# EasyEDA Pro project ProProject_fpga_cpu_2024-09-28.epro, board PCB3
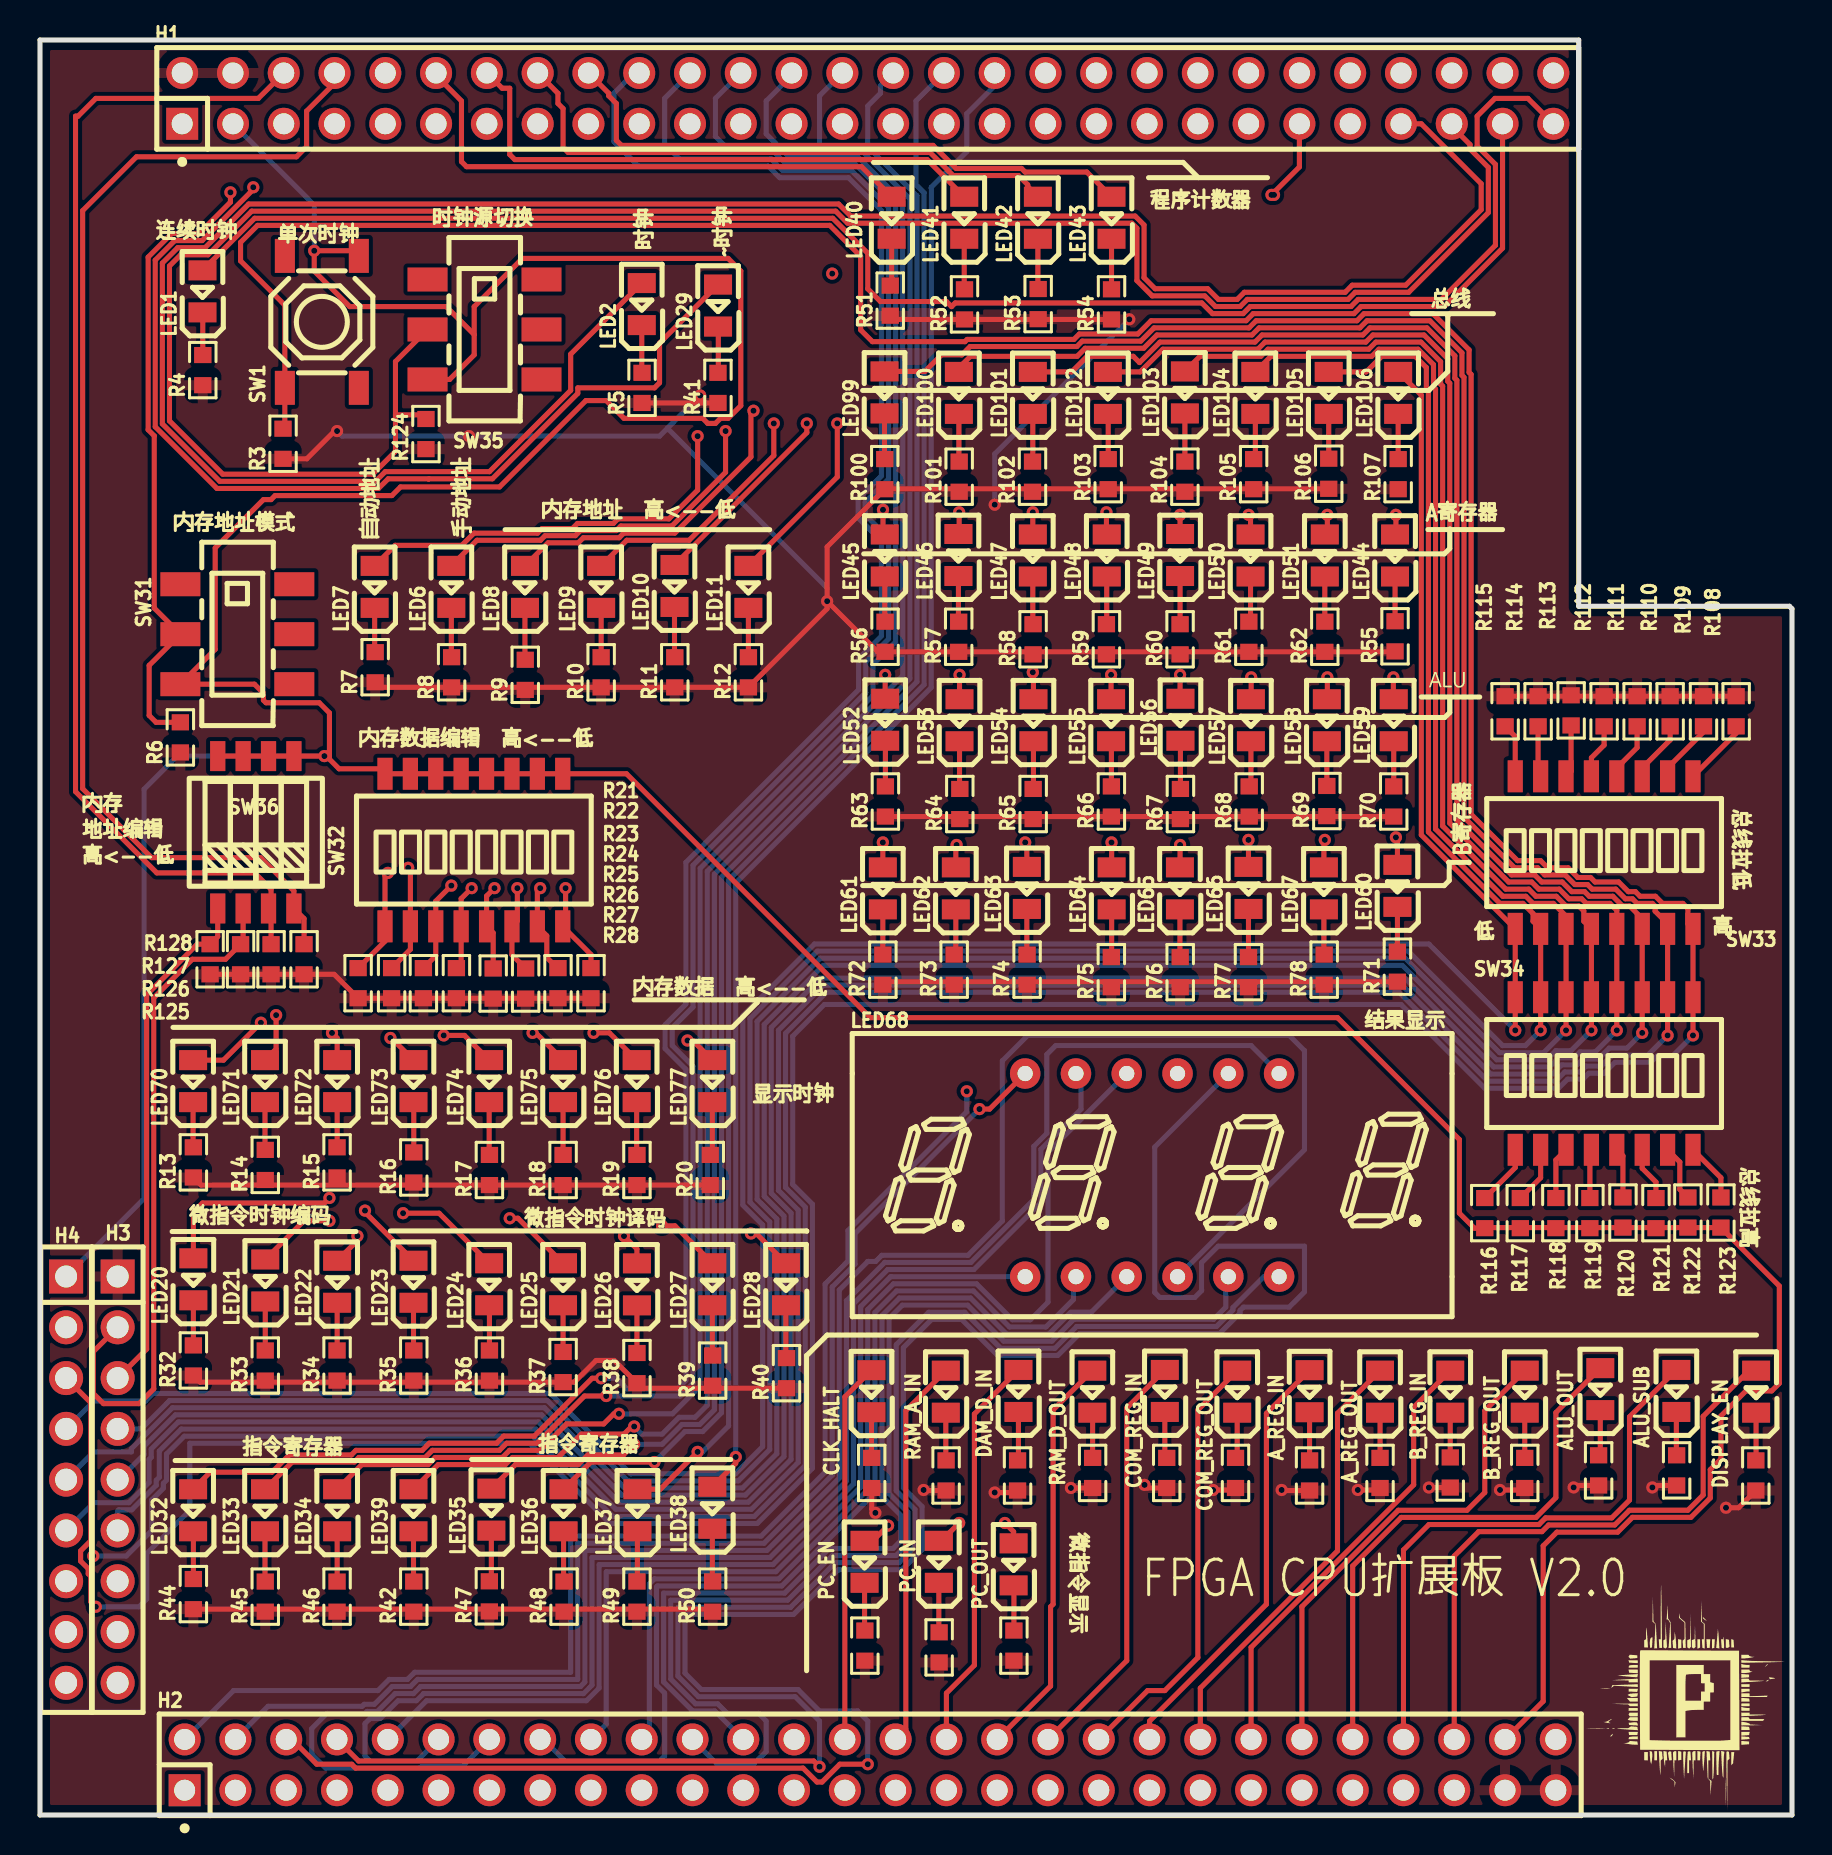
[diagram p3: board, top side]
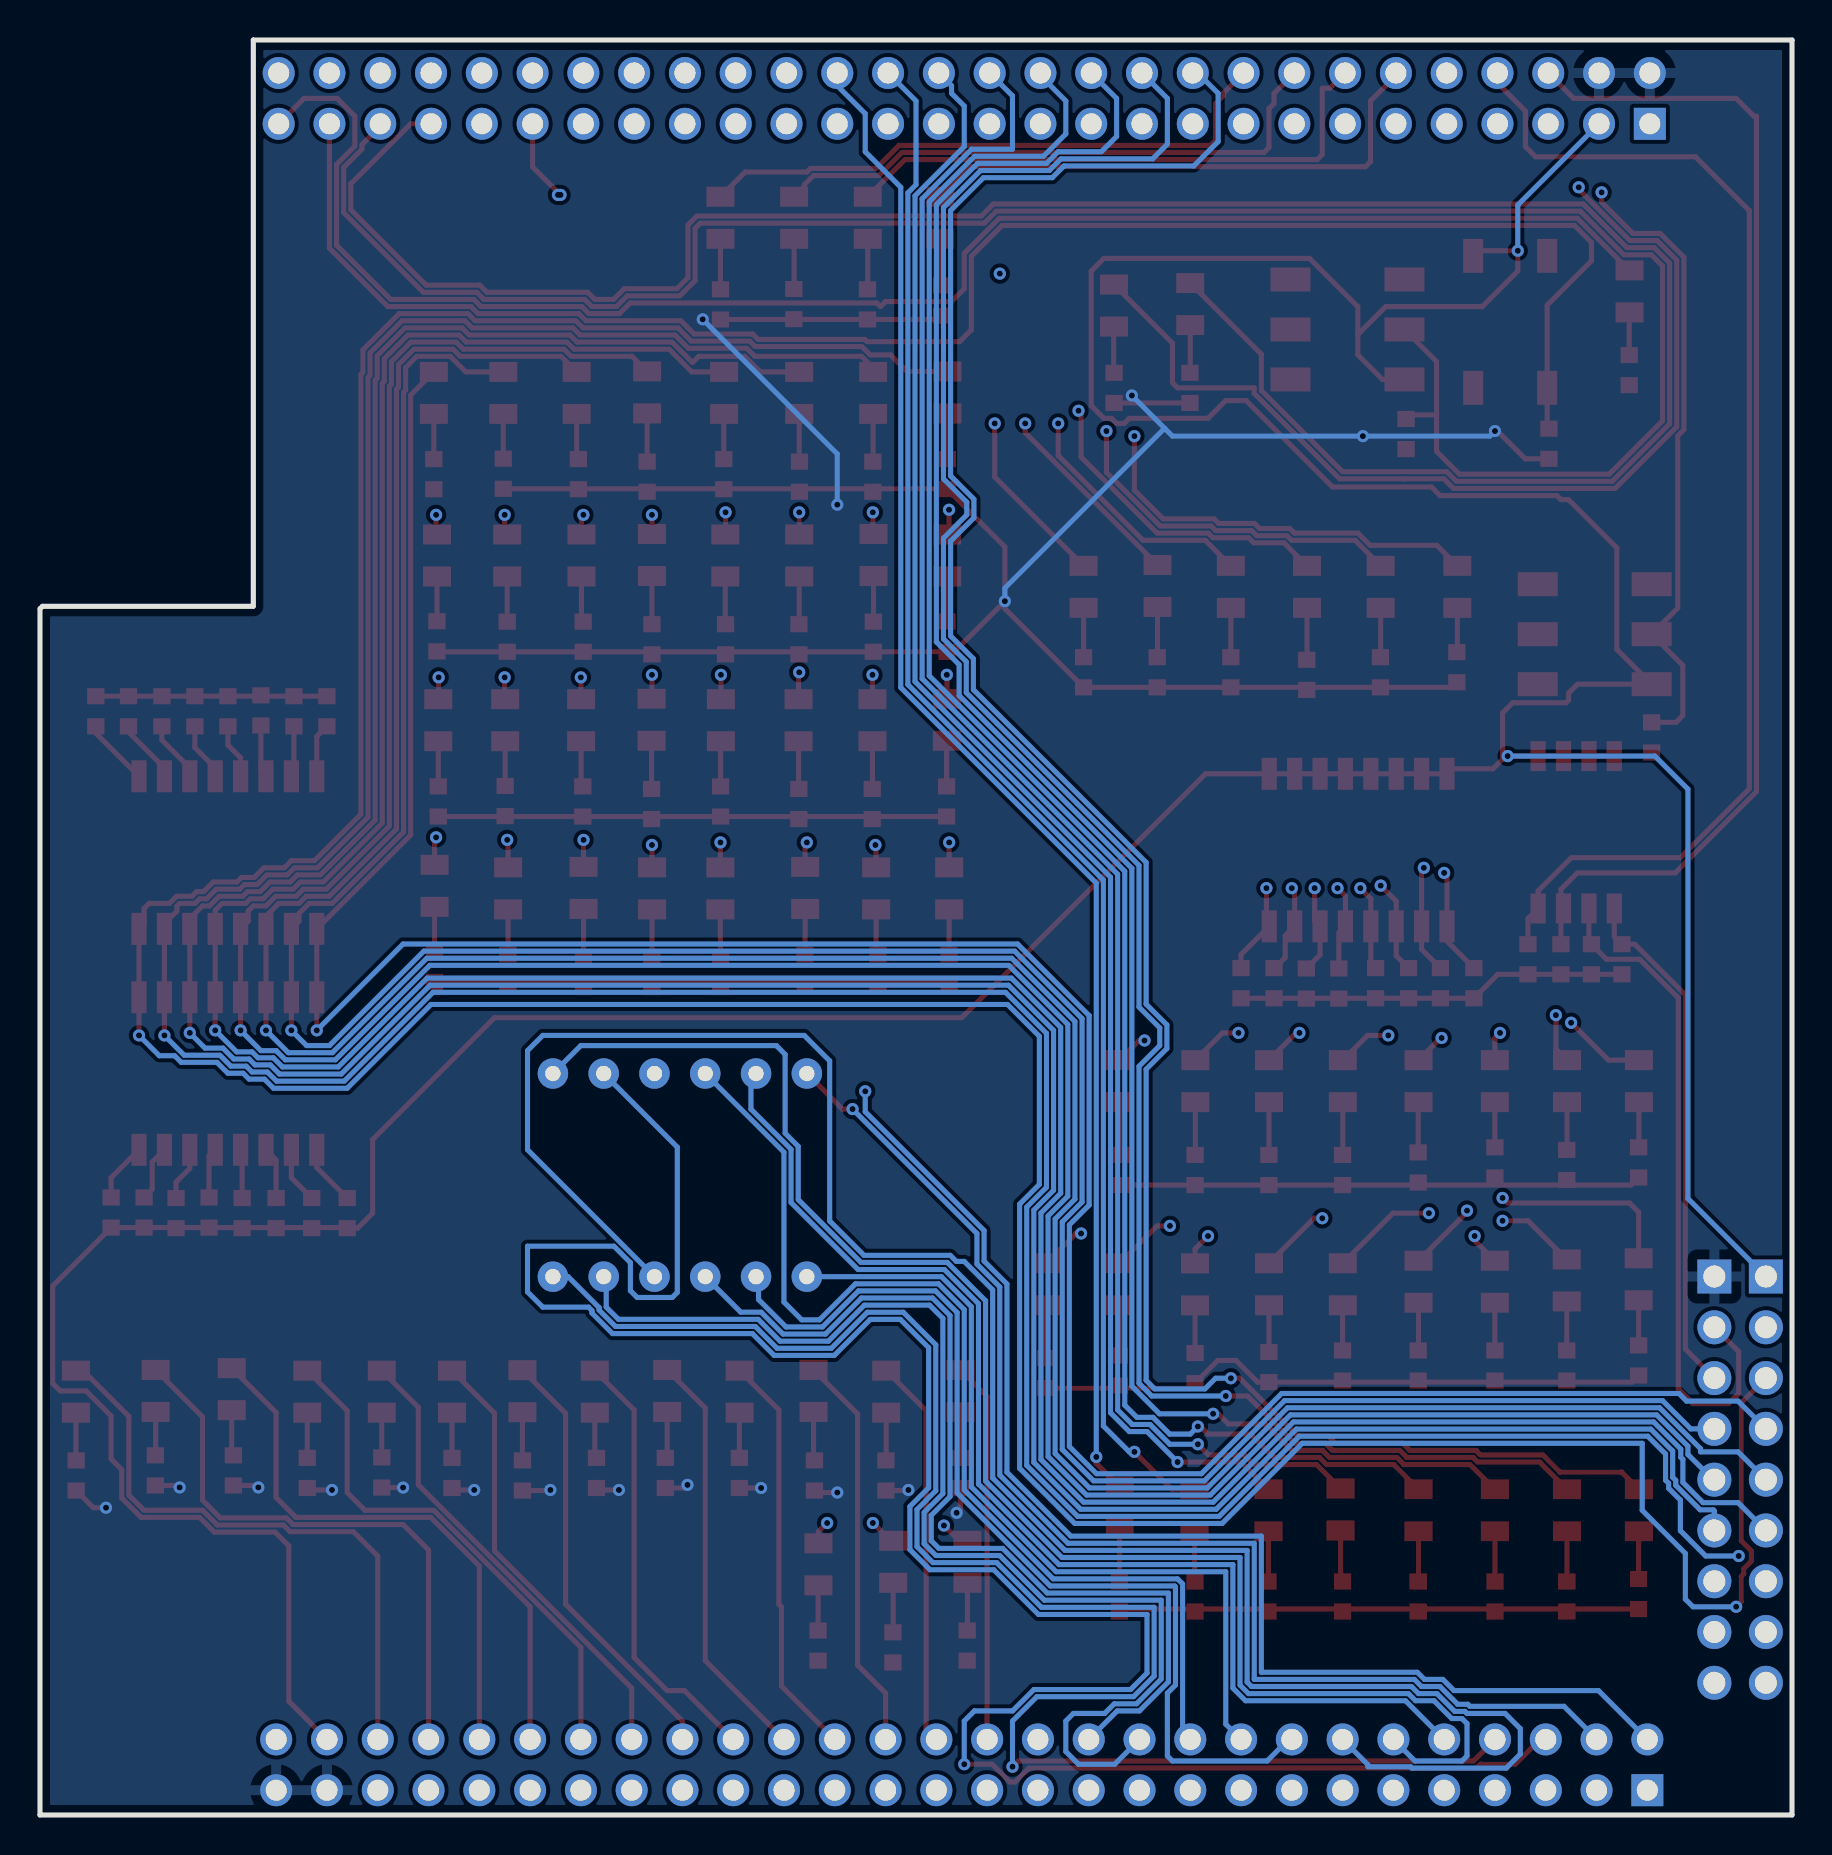
[diagram p4: board, bottom side, seen from below]

Outline 87.63 x 88.77 mm; copper layers: Top Layer, Inner1, Inner2, Bottom Layer. Coordinates in mm from the lower left corner of the outline.
Outline path: 0,88.77 76.96,88.77 76.96,60.45 87.5,60.45 87.63,60.33 87.63,0 0,0 0,88.77
Stack: Top Layer 0.035mm 外层铜厚1oz / Dielectric1 0.2104mm 7628 RC49% 8.6mil / Inner1 0.0152mm 内层铜厚 / Dielectric2 1.065mm 1.1mm H/HOZ 含铜 / Inner2 0.0152mm 内层铜厚 / Dielectric3 0.2104mm 7628 RC49% 8.6mil / Bottom Layer 0.035mm 外层铜厚1oz

## Design rules (mm)
template: JLCPCB Capability(Two Layers Board)
spacing copperThickness1oz (default): track to track 0.102, other pairs 0.152 to 0.3
spacing copperThickness2oz: track to track 0.203, other pairs 0.152 to 0.3
track width copperThickness1oz (default): min 0.127, default 0.254, max 2.54
track width copperThickness2oz: min 0.203, default 0.254, max 2.54
differential pair differentialPair (default): width min 0.127, default 0.254, max 2.54; gap min 0.152, default 0.152
via viaSize (default): diameter min 0.5, default 0.61, max 10; hole min 0.3, default 0.305, max 6.3

## Placement (name value [footprint] x y rotation side)
A_REG_IN  KT-0805G  [LED0805-R-RD]  63.5 21.2 90 top
A_REG_OUT  KT-0805G  [LED0805-R-RD]  67.02 21.17 90 top
ALU_OUT  KT-0805G  [LED0805-R-RD]  78.04 21.3 90 top
ALU_SUB  KT-0805G  [LED0805-R-RD]  81.84 21.21 90 top
B_REG_IN  KT-0805G  [LED0805-R-RD]  70.54 21.17 90 top
B_REG_OUT  KT-0805G  [LED0805-R-RD]  74.26 21.17 90 top
CLK_HALT  KT-0805G  [LED0805-R-RD]  41.59 21.2 90 top
COM_REG_IN  KT-0805G  [LED0805-R-RD]  56.26 21.21 90 top
COM_REG_OUT  KT-0805G  [LED0805-R-RD]  59.88 21.17 90 top
DAM_D_IN  KT-0805G  [LED0805-R-RD]  48.94 21.21 90 top
DISPLAY_EN  KT-0805G  [LED0805-R-RD]  85.83 21.17 90 top
H1  X6521WV-2x28H-C60D30  [HDR-TH_56P-2.54-V-M-R2-C28-S2.54]  41.4 85.85 0 top
H2  X6521WV-2x28H-C60D30  [HDR-TH_56P-2.54-V-M-R2-C28-S2.54]  41.53 2.51 0 top
H3  -  [HDR-TH_9P-P2.54-V-M]  3.88 16.77 270 top
H4  -  [HDR-TH_9P-P2.54-V-M]  1.31 16.77 270 top
LED1  KT-0805Y  [LED0805-R-RD]  8.13 76.2 90 top
LED2  KT-0805Y  [LED0805-R-RD]  30.1 75.57 90 top
LED6  KT-0805Y  [LED0805-R-RD]  20.57 61.42 90 top
LED7  KT-0805G  [LED0805-R-RD]  16.74 61.42 90 top
LED8  KT-0805Y  [LED0805-R-RD]  24.26 61.42 90 top
LED9  KT-0805Y  [LED0805-R-RD]  28.07 61.42 90 top
LED10  KT-0805Y  [LED0805-R-RD]  31.74 61.47 90 top
LED11  KT-0805Y  [LED0805-R-RD]  35.43 61.42 90 top
LED20  KT-0805Y  [LED0805-R-RD]  7.67 26.79 90 top
LED21  KT-0805Y  [LED0805-R-RD]  11.27 26.73 90 top
LED22  KT-0805Y  [LED0805-R-RD]  14.86 26.67 90 top
LED23  KT-0805G  [LED0805-R-RD]  18.68 26.67 90 top
LED24  KT-0805G  [LED0805-R-RD]  22.47 26.54 90 top
LED25  KT-0805G  [LED0805-R-RD]  26.16 26.54 90 top
LED26  KT-0805G  [LED0805-R-RD]  29.86 26.54 90 top
LED27  KT-0805G  [LED0805-R-RD]  33.63 26.54 90 top
LED28  KT-0805G  [LED0805-R-RD]  37.31 26.54 90 top
LED29  KT-0805Y  [LED0805-R-RD]  33.91 75.49 90 top
LED32  KT-0805G  [LED0805-R-RD]  7.66 15.24 90 top
LED33  KT-0805G  [LED0805-R-RD]  11.25 15.24 90 top
LED34  KT-0805G  [LED0805-R-RD]  14.86 15.24 90 top
LED35  KT-0805Y  [LED0805-R-RD]  22.58 15.27 90 top
LED36  KT-0805Y  [LED0805-R-RD]  26.19 15.24 90 top
LED37  KT-0805Y  [LED0805-R-RD]  29.88 15.24 90 top
LED38  KT-0805Y  [LED0805-R-RD]  33.63 15.37 90 top
LED39  KT-0805G  [LED0805-R-RD]  18.68 15.24 90 top
LED40  KT-0805G  [LED0805-R-RD]  42.6 79.88 90 top
LED41  KT-0805G  [LED0805-R-RD]  46.23 79.88 90 top
LED42  KT-0805G  [LED0805-R-RD]  49.91 79.88 90 top
LED43  KT-0805G  [LED0805-R-RD]  53.59 79.88 90 top
LED44  KT-0805W  [LED0805-R-RD]  67.77 62.99 90 top
LED45  KT-0805W  [LED0805-R-RD]  42.25 62.99 90 top
LED46  KT-0805W  [LED0805-R-RD]  45.94 63.02 90 top
LED47  KT-0805W  [LED0805-R-RD]  49.66 62.99 90 top
LED48  KT-0805W  [LED0805-R-RD]  53.35 62.99 90 top
LED49  KT-0805W  [LED0805-R-RD]  57.02 63.02 90 top
LED50  KT-0805W  [LED0805-R-RD]  60.55 62.99 90 top
LED51  KT-0805W  [LED0805-R-RD]  64.26 62.99 90 top
LED52  KT-0805G  [LED0805-R-RD]  42.27 54.78 90 top
LED53  KT-0805G  [LED0805-R-RD]  45.99 54.75 90 top
LED54  KT-0805G  [LED0805-R-RD]  49.69 54.75 90 top
LED55  KT-0805G  [LED0805-R-RD]  53.57 54.75 90 top
LED56  KT-0805G  [LED0805-R-RD]  57.04 54.78 90 top
LED57  KT-0805G  [LED0805-R-RD]  60.57 54.75 90 top
LED58  KT-0805G  [LED0805-R-RD]  64.36 54.75 90 top
LED59  KT-0805G  [LED0805-R-RD]  67.71 54.75 90 top
LED60  KT-0805W  [LED0805-R-RD]  67.89 46.47 90 top
LED61  KT-0805W  [LED0805-R-RD]  42.16 46.34 90 top
LED62  KT-0805W  [LED0805-R-RD]  45.81 46.34 90 top
LED63  KT-0805W  [LED0805-R-RD]  49.36 46.37 90 top
LED64  KT-0805W  [LED0805-R-RD]  53.6 46.34 90 top
LED65  KT-0805W  [LED0805-R-RD]  57.02 46.34 90 top
LED66  KT-0805W  [LED0805-R-RD]  60.44 46.37 90 top
LED67  KT-0805W  [LED0805-R-RD]  64.22 46.34 90 top
LED68  FJ3461AH  [LED-SEG-TH_12P-L30.0-W14.0-P2.54-S10.16-BL]  55.63 32 0 top
LED70  NCD0805R1  [LED0805-R-RD]  7.66 36.7 90 top
LED71  NCD0805R1  [LED0805-R-RD]  11.25 36.7 90 top
LED72  NCD0805R1  [LED0805-R-RD]  14.86 36.7 90 top
LED73  NCD0805R1  [LED0805-R-RD]  18.68 36.7 90 top
LED74  NCD0805R1  [LED0805-R-RD]  22.47 36.7 90 top
LED75  NCD0805R1  [LED0805-R-RD]  26.16 36.7 90 top
LED76  NCD0805R1  [LED0805-R-RD]  29.84 36.7 90 top
LED77  NCD0805R1  [LED0805-R-RD]  33.63 36.7 90 top
LED99  KT-0805Y  [LED0805-R-RD]  42.24 71.15 90 top
LED100  KT-0805Y  [LED0805-R-RD]  45.96 71.12 90 top
LED101  KT-0805Y  [LED0805-R-RD]  49.66 71.12 90 top
LED102  KT-0805Y  [LED0805-R-RD]  53.41 71.12 90 top
LED103  KT-0805Y  [LED0805-R-RD]  57.26 71.15 90 top
LED104  KT-0805Y  [LED0805-R-RD]  60.79 71.12 90 top
LED105  KT-0805Y  [LED0805-R-RD]  64.46 71.12 90 top
LED106  KT-0805Y  [LED0805-R-RD]  67.93 71.12 90 top
PC_EN  KT-0805G  [LED0805-R-RD]  41.24 12.66 90 top
PC_IN  KT-0805G  [LED0805-R-RD]  44.96 12.66 90 top
PC_OUT  KT-0805G  [LED0805-R-RD]  48.7 12.54 90 top
R3  1kΩ  [R0603]  12.16 68.58 90 top
R4  330Ω  [R0603]  8.14 72.26 90 top
R5  330Ω  [R0603]  30.11 71.37 90 top
R6  1kΩ  [R0603]  7.02 53.89 90 top
R7  330Ω  [R0603]  16.76 57.4 90 top
R8  330Ω  [R0603]  20.59 57.15 90 top
R9  330Ω  [R0603]  24.27 57.02 90 top
R10  330Ω  [R0603]  28.07 57.15 90 top
R11  330Ω  [R0603]  31.75 57.15 90 top
R12  330Ω  [R0603]  35.43 57.15 90 top
R13  330Ω  [R0603]  7.67 32.64 90 top
R14  330Ω  [R0603]  11.27 32.51 90 top
R15  330Ω  [R0603]  14.86 32.64 90 top
R16  330Ω  [R0603]  18.7 32.39 90 top
R17  330Ω  [R0603]  22.48 32.26 90 top
R18  330Ω  [R0603]  26.16 32.26 90 top
R19  330Ω  [R0603]  29.86 32.26 90 top
R20  330Ω  [R0603]  33.52 32.26 90 top
R21  1kΩ  [R0603]  15.91 41.6 90 top
R22  1kΩ  [R0603]  17.59 41.6 90 top
R23  1kΩ  [R0603]  19.18 41.6 90 top
R24  1kΩ  [R0603]  20.83 41.6 90 top
R25  1kΩ  [R0603]  22.67 41.58 90 top
R26  1kΩ  [R0603]  24.29 41.58 90 top
R27  1kΩ  [R0603]  25.91 41.6 90 top
R28  1kΩ  [R0603]  27.56 41.6 90 top
R32  330Ω  [R0603]  7.67 22.73 90 top
R33  330Ω  [R0603]  11.27 22.48 90 top
R34  330Ω  [R0603]  14.86 22.48 90 top
R35  330Ω  [R0603]  18.7 22.48 90 top
R36  330Ω  [R0603]  22.48 22.48 90 top
R37  330Ω  [R0603]  26.16 22.4 90 top
R38  330Ω  [R0603]  29.86 22.35 90 top
R39  330Ω  [R0603]  33.64 22.23 90 top
R40  330Ω  [R0603]  37.34 22.1 90 top
R41  330Ω  [R0603]  33.91 71.37 90 top
R42  330Ω  [R0603]  18.7 10.92 90 top
R44  330Ω  [R0603]  7.67 11.05 90 top
R45  330Ω  [R0603]  11.27 10.92 90 top
R46  330Ω  [R0603]  14.86 10.92 90 top
R47  330Ω  [R0603]  22.48 10.94 90 top
R48  330Ω  [R0603]  26.21 10.92 90 top
R49  330Ω  [R0603]  29.86 10.92 90 top
R50  330Ω  [R0603]  33.64 10.92 90 top
R51  330Ω  [R0603]  42.53 75.74 90 top
R52  330Ω  [R0603]  46.24 75.55 90 top
R53  330Ω  [R0603]  49.92 75.57 90 top
R54  330Ω  [R0603]  53.59 75.55 90 top
R55  330Ω  [R0603]  67.77 58.95 90 top
R56  330Ω  [R0603]  42.27 58.93 90 top
R57  330Ω  [R0603]  45.95 58.93 90 top
R58  330Ω  [R0603]  49.67 58.8 90 top
R59  330Ω  [R0603]  53.34 58.8 90 top
R60  330Ω  [R0603]  57.02 58.8 90 top
R61  330Ω  [R0603]  60.46 58.93 90 top
R62  330Ω  [R0603]  64.26 58.93 90 top
R63  330Ω  [R0603]  42.28 50.69 90 top
R64  330Ω  [R0603]  46.01 50.56 90 top
R65  330Ω  [R0603]  49.67 50.56 90 top
R66  330Ω  [R0603]  53.59 50.69 90 top
R67  330Ω  [R0603]  57.04 50.56 90 top
R68  330Ω  [R0603]  60.48 50.69 90 top
R69  330Ω  [R0603]  64.36 50.71 90 top
R70  330Ω  [R0603]  67.71 50.69 90 top
R71  330Ω  [R0603]  67.89 42.43 90 top
R72  330Ω  [R0603]  42.16 42.28 90 top
R73  330Ω  [R0603]  45.72 42.28 90 top
R74  330Ω  [R0603]  49.37 42.28 90 top
R75  330Ω  [R0603]  53.59 42.15 90 top
R76  330Ω  [R0603]  57.03 42.15 90 top
R77  330Ω  [R0603]  60.44 42.15 90 top
R78  330Ω  [R0603]  64.23 42.28 90 top
R80  330Ω  [R0603]  41.6 17.11 90 top
R81  330Ω  [R0603]  45.32 16.98 90 top
R82  330Ω  [R0603]  48.89 16.98 90 top
R83  330Ω  [R0603]  52.65 17.11 90 top
R84  330Ω  [R0603]  56.36 17.11 90 top
R85  330Ω  [R0603]  59.8 17.11 90 top
R86  330Ω  [R0603]  63.5 16.98 90 top
R87  330Ω  [R0603]  67.02 17.11 90 top
R88  330Ω  [R0603]  70.54 17.13 90 top
R89  330Ω  [R0603]  74.26 17.11 90 top
R90  330Ω  [R0603]  77.96 17.24 90 top
R91  330Ω  [R0603]  81.86 17.24 90 top
R92  330Ω  [R0603]  85.82 16.98 90 top
R93  330Ω  [R0603]  41.26 8.47 90 top
R94  330Ω  [R0603]  44.97 8.38 90 top
R95  330Ω  [R0603]  48.71 8.47 90 top
R100  330Ω  [R0603]  42.25 67.06 90 top
R101  330Ω  [R0603]  45.97 66.93 90 top
R102  330Ω  [R0603]  49.64 66.93 90 top
R103  330Ω  [R0603]  53.43 67.06 90 top
R104  330Ω  [R0603]  57.26 66.93 90 top
R105  330Ω  [R0603]  60.7 67.06 90 top
R106  330Ω  [R0603]  64.46 67.08 90 top
R107  330Ω  [R0603]  67.93 67.06 90 top
R108  1kΩ  [R0603]  84.84 55.2 270 top
R109  1kΩ  [R0603]  83.2 55.2 270 top
R110  1kΩ  [R0603]  81.53 55.2 270 top
R111  1kΩ  [R0603]  79.88 55.2 270 top
R112  1kΩ  [R0603]  78.23 55.2 270 top
R113  1kΩ  [R0603]  76.58 55.25 270 top
R114  1kΩ  [R0603]  74.93 55.2 270 top
R115  1kΩ  [R0603]  73.28 55.2 270 top
R116  1kΩ  [R0603]  72.26 30.1 90 top
R117  1kΩ  [R0603]  74.04 30.1 90 top
R118  1kΩ  [R0603]  75.82 30.1 90 top
R119  1kΩ  [R0603]  77.52 30.1 90 top
R120  1kΩ  [R0603]  79.17 30.13 90 top
R121  1kΩ  [R0603]  80.83 30.1 90 top
R122  1kΩ  [R0603]  82.42 30.13 90 top
R123  1kΩ  [R0603]  84.07 30.13 90 top
R124  1kΩ  [R0603]  19.3 69.06 90 top
R125  1kΩ  [R0603]  8.51 42.8 90 top
R126  1kΩ  [R0603]  10.03 42.8 90 top
R127  1kΩ  [R0603]  11.56 42.8 90 top
R128  1kΩ  [R0603]  13.21 42.8 90 top
RAM_A_IN  KT-0805G  [LED0805-R-RD]  45.31 21.17 90 top
RAM_D_OUT  KT-0805G  [LED0805-R-RD]  52.63 21.17 90 top
SW1  TS-1187A-B-A-B  [SW-SMD_4P-L5.1-W5.1-P3.70-LS6.5-TL-2]  14.1 74.68 90 top
SW31  MST22D18G2  [SW-SMD_MST22D18G2]  9.87 59.06 270 top
SW32  DSHP08TSGER  [SW-SMD_16P-L11.7-W5.4-P1.27-LS8.5]  21.7 48.26 0 top
SW33  DSHP08TSGER  [SW-SMD_16P-L11.7-W5.4-P1.27-LS8.5]  78.23 48.13 180 top
SW34  DSHP08TSGER  [SW-SMD_16P-L11.7-W5.4-P1.27-LS8.5]  78.23 37.08 0 top
SW35  MST22D18G2  [SW-SMD_MST22D18G2]  22.23 74.3 270 top
SW36  DSHP04TS-S  [SW-SMD_8P-L6.7-W5.4-P1.27-LS8.5]  10.8 49.15 0 top

## Footprints (pads in the part's own frame, mm; a bottom-side part is the same pattern mirrored in y, then rotated)
HDR-TH_9P-P2.54-V-M
  rect 1.7x1.7 hole 1.1: 1(-10.16,0)
  round 1.7 hole 1.1: 2(-7.62,0) 3(-5.08,0) 4(-2.54,0) 5(0,0) 6(2.54,0) 7(5.08,0) 8(7.62,0) 9(10.16,0)
HDR-TH_56P-2.54-V-M-R2-C28-S2.54
  rect 1.6x1.6 hole 1.05: 1(-34.29,-1.27)
  round 1.6 hole 1.05: 2(-34.29,1.27) 3(-31.75,-1.27) 4(-31.75,1.27) 5(-29.21,-1.27) 6(-29.21,1.27) 7(-26.67,-1.27) 8(-26.67,1.27) 9(-24.13,-1.27) 10(-24.13,1.27) 11(-21.59,-1.27) 12(-21.59,1.27) 13(-19.05,-1.27) 14(-19.05,1.27) 15(-16.51,-1.27) 16(-16.51,1.27) 17(-13.97,-1.27) 18(-13.97,1.27) 19(-11.43,-1.27) 20(-11.43,1.27) 21(-8.89,-1.27) 22(-8.89,1.27) 23(-6.35,-1.27) 24(-6.35,1.27) 25(-3.81,-1.27) 26(-3.81,1.27) 27(-1.27,-1.27) 28(-1.27,1.27) 29(1.27,-1.27) 30(1.27,1.27) 31(3.81,-1.27) 32(3.81,1.27) 33(6.35,-1.27) 34(6.35,1.27) 35(8.89,-1.27) 36(8.89,1.27) 37(11.43,-1.27) 38(11.43,1.27) 39(13.97,-1.27) 40(13.97,1.27) 41(16.51,-1.27) 42(16.51,1.27) 43(19.05,-1.27) 44(19.05,1.27) 45(21.59,-1.27) 46(21.59,1.27) 47(24.13,-1.27) 48(24.13,1.27) 49(26.67,-1.27) 50(26.67,1.27) 51(29.21,-1.27) 52(29.21,1.27) 53(31.75,-1.27) 54(31.75,1.27) 55(34.29,-1.27) 56(34.29,1.27)
LED0805-R-RD
  rect 1x1.399 smd: 1(1.05,0) 2(-1.05,0)
LED-SEG-TH_12P-L30.0-W14.0-P2.54-S10.16-BL
  round 1.524 hole 0.762: 1(-6.35,-5.08) 2(-3.81,-5.08) 3(-1.27,-5.08) 4(1.27,-5.08) 5(3.81,-5.08) 6(6.35,-5.08) 7(6.35,5.08) 8(3.81,5.08) 9(1.27,5.08) 10(-1.27,5.08) 11(-3.81,5.08) 12(-6.35,5.08)
R0603
  rect 0.806x0.864 smd: 1(-0.753,0) 2(0.753,0)
SW-SMD_4P-L5.1-W5.1-P3.70-LS6.5-TL-2
  rect 1.7x1 smd: 1(-3.3,1.85) 2(3.3,1.85) 3(-3.3,-1.85) 4(3.3,-1.85)
SW-SMD_8P-L6.7-W5.4-P1.27-LS8.5
  rect 0.762x1.5 smd: 1(-1.905,-3.81) 2(-0.635,-3.81) 3(0.635,-3.81) 4(1.905,-3.81) 5(1.905,3.81) 6(0.635,3.81) 7(-0.635,3.81) 8(-1.905,3.81)
SW-SMD_16P-L11.7-W5.4-P1.27-LS8.5
  rect 0.76x1.6 smd: 1(-4.445,-3.815) 2(-3.175,-3.815) 3(-1.905,-3.815) 4(-0.635,-3.815) 5(0.635,-3.815) 6(1.905,-3.815) 7(3.175,-3.815) 8(4.445,-3.815) 9(-4.445,3.815) 10(-3.175,3.815) 11(-1.905,3.815) 12(-0.635,3.815) 13(0.635,3.815) 14(1.905,3.815) 15(3.175,3.815) 16(4.445,3.815)
SW-SMD_MST22D18G2
  rect 1.2x2 smd: 1(-2.5,2.85) 2(0,2.85) 3(2.5,2.85) 4(-2.5,-2.85) 5(0,-2.85) 6(2.5,-2.85)

## Nets
As in the schematic, except:
AA8: ALU_SUB.1 H2.50
AB6: ALU_OUT.1 H2.48
AB7: B_REG_OUT.1 H2.46
COMMAND_R1: CLK_HALT.1 H2.28
COMMAND_R2: H2.30 RAM_A_IN.1
COMMAND_R3: DAM_D_IN.1 H2.32
COMMAND_R4: H2.34 RAM_D_OUT.1
COMMAND_R5: COM_REG_IN.1 H2.36
COMMAND_R6: COM_REG_OUT.1 H2.38
COMMAND_R7: A_REG_IN.1 H2.40
COMMAND_R8: A_REG_OUT.1 H2.42
COMMAND_R9: B_REG_IN.1 H2.44
COMMAND_R13: DISPLAY_EN.1 H2.52
COMMAND_R14: H2.3 PC_EN.1
COMMAND_R15: H2.1 PC_IN.1
COMMAND_R16: H1.10 PC_OUT.1
$1N12783: CLK_HALT.2 R80.2
$1N12882: R81.2 RAM_A_IN.2
$1N13075: DAM_D_IN.2 R82.2
$1N13079: R83.2 RAM_D_OUT.2
$1N13657: COM_REG_IN.2 R84.2
$1N13661: COM_REG_OUT.2 R85.2
$1N13665: A_REG_IN.2 R86.2
$1N13669: A_REG_OUT.2 R87.2
$1N14429: B_REG_IN.2 R88.2
$1N14433: B_REG_OUT.2 R89.2
$1N14437: ALU_OUT.2 R90.2
$1N14441: ALU_SUB.2 R91.2
$1N14445: DISPLAY_EN.2 R92.2
$1N14449: PC_EN.2 R93.2
$1N14453: PC_IN.2 R94.2
$1N14457: PC_OUT.2 R95.2

Pads without a net: H3 7 8 9; H4 7 8 9; SW1 2 3; SW31 1 2 3 4; SW35 1 2 3 4

## Via types
v1: diameter 0.61, hole 0.305, Top Layer to Bottom Layer, 106 vias

## Routing (per net, layer and track width the routed paths; a pad name or vN(x,y) marks a point on that pad's centre or on a via; arc(x,y) is an arc through that point)
+3.3V: length 255.2
  Top Layer w0.254: SW1.4 15.69,78.23 v1(13.72,78.23) 13.72,77.22 15.49,75.44 20.32,75.44 21.72,74.04 ; 21.72,74.04 21.72,73.03 20.49,71.8 SW35.6 ; 21.72,74.04 21.72,75.44 24.13,77.85 34.42,77.85 35.05,77.22 35.05,70.49 34.42,69.85 34.04,69.85 33.78,69.6 33.4,69.6 33.15,69.85 29.21,69.85 28.32,70.74 27.31,70.74 22.99,66.42 18.03,66.42 17.6,65.99 11.76,65.99 11.56,65.79 11.18,65.79 8.76,63.37 8.76,58.3 SW31.6 10.73,56.56 11.18,56.1 11.18,55.75 11.3,55.63 13.97,55.63 14.48,55.12 14.48,53.21 ; H2.54 75.18,5.69 75.18,13.46 75.87,14.15 78.91,14.15 79.65,14.89 82.57,14.89 83.54,15.85 83.54,17.27 84.07,17.81 84.07,19.96 85.32,21.21 86.61,21.21 87,21.59 87,26.46 R123.1 R122.1 R120.1 72.29,29.38 R116.1 71.74,29.35 70.99,30.1 70.99,33.78 64.9,39.88 41.53,39.88 29.33,52.08 SW32.16 SW32.15 SW32.14 SW32.13 SW32.12 SW32.11 SW32.10 SW32.9 17.01,52.32 14.96,52.32 14.48,52.8 14.48,53.21 ; SW36.8 SW36.7 SW36.6 SW36.5 14.22,52.96 14.48,53.21
  Bottom Layer w0.254: H4.1 5.21,30.83 5.21,51.31 6.86,52.96 v1(14.22,52.96) ; v1(13.72,78.23) 13.72,80.52 H1.3
GND: length 379.3
  Top Layer w0.254: R88.1 v1(69.47,16.38) ; v1(58.67,16.26) 59.7,16.26 R85.1 ; R84.1 55.4,16.36 v1(55.25,16.51) ; R91.1 80.74,16.48 v1(80.64,16.38) ; v1(14.86,69.22) 14.73,69.22 13.34,67.83 R3.1 ; R90.1 76.81,16.48 v1(76.71,16.38) ; v1(65.91,16.26) 66.92,16.26 R87.1 ; R81.1 44.22,16.23 v1(44.2,16.26) ; R44.1 33.52,10.3 R50.1 ; R32.1 8,21.65 R37.1 26.73,21.65 27.81,22.73 28.72,22.73 R38.1 30.11,21.34 R40.1 ; v1(41.78,15.11) 41.6,15.3 R80.1 ; R86.1 62.13,16.23 v1(62.1,16.26) ; R20.1 R19.1 R18.1 R17.1 8.05,31.5 R13.1 ; 42.16,41.53 42.31,41.67 R71.1 ; R5.1 33.8,70.62 33.93,70.49 ; R51.1 42.71,74.8 53.59,74.8 ; R55.1 67.75,58.17 R62.1 R61.1 R57.1 R56.1 41.9,58.17 v1(39.37,60.71) ; R115.1 R114.1 R112.1 R111.1 R110.1 R109.1 R108.1 ; R70.1 R68.1 R66.1 R63.1 ; v1(47.75,16.13) 48.8,16.13 R82.1 ; v1(39.37,60.71) 39.37,60.33 R12.1 R11.1 R10.1 R8.1 17.02,56.4 R7.1 ; v1(39.37,60.71) 39.37,63.42 R100.1 42.28,66.33 R106.1 ; R83.1 v1(51.56,16.36) ; R125.1 R126.1 R127.1 R128.1 14.71,42.04 R21.1 R22.1 R23.1 R24.1 R27.1 R28.1 ; R89.1 74.16,16.26 v1(73.03,16.26) ; R92.1 84.96,15.37 v1(84.33,15.37)
  Inner1 w0.254: 76.71,15.37 80.55,15.37 ; 76.71,15.37 73.02,15.37 ; 76.71,15.37 v1(76.71,16.38) ; 80.55,15.37 v1(84.33,15.37) ; 80.55,15.37 80.64,15.46 v1(80.64,16.38) ; v1(73.03,16.26) 73.03,15.37 73.02,15.37 ; 65.79,15.37 65.79,16.13 v1(65.91,16.26) ; 65.79,15.37 69.41,15.37 ; 65.79,15.37 62.1,15.37 ; v1(69.47,16.38) 69.47,15.42 69.41,15.37 ; 47.78,15.37 47.75,15.39 v1(47.75,16.13) ; 47.78,15.37 51.56,15.37 ; 47.78,15.37 42.04,15.37 v1(41.78,15.11) ; 69.41,15.37 73.02,15.37 ; v1(62.1,16.26) 62.1,15.37 ; 62.1,15.37 58.66,15.37 ; 55.25,15.37 58.66,15.37 ; 55.25,15.37 51.56,15.37 ; 55.25,15.37 55.25,15.37 v1(55.25,16.51) ; 58.66,15.37 58.67,15.38 v1(58.67,16.26) ; v1(51.56,16.36) 51.56,15.37 ; v1(44.2,16.26) 44.2,15.37
  Bottom Layer w0.254: v1(39.37,60.71) 39.37,61.36 31.38,69.35 ; v1(33.02,70.99) 31.38,69.35 ; 31.38,69.35 30.99,68.96 v1(21.46,68.96) 15.11,68.96 v1(14.86,69.22) ; v1(54.48,74.8) 47.75,68.07 v1(47.75,65.53)
AA8: length 29.3
  Top Layer w0.254: ALU_SUB.1 79.5,19.92 79.5,15.75 78.61,14.86 75.31,14.86 74.98,14.53 69.47,14.53 68.2,13.26 H2.50
AA18: length 53.6
  Bottom Layer w0.254: LED68.10 50.42,33.15 50.42,25.65 49.53,24.77 48.64,24.77 46.84,26.57 42.69,26.57 41.4,25.28 41.4,16.26 36.95,11.81 30.73,11.81 30.48,11.56 30.48,4.16 H2.20
AB6: length 27.7
  Top Layer w0.254: H2.48 65.66,12.46 68.08,14.88 74.83,14.88 75.82,15.88 75.82,20.13 ALU_OUT.1
AB7: length 25.1
  Top Layer w0.254: H2.46 63.12,10.42 67.94,15.24 71.37,15.24 72.26,16.13 72.26,20.22 B_REG_OUT.1
AB8: length 153.8
  Top Layer w0.254: v1(45.85,48.51) 45.81,48.48 LED62.1
  Inner1 w0.254: H2.49 66.8,2.63 66.8,4.32 66.17,4.95 64.39,4.95 63.9,5.43 61.74,5.43 61.38,5.79 59.47,5.79 59.06,6.21 57.02,6.21 56.54,6.69 54.63,6.69 53.91,7.4 49.59,7.4 49.29,7.7 47.64,7.7 47.22,8.12 44.93,8.12 44.45,8.6 42.66,8.6 41.91,9.35 35.67,9.35 35.15,9.87 30.7,9.87 30.09,10.48 28.71,10.48 28.06,11.13 23.46,11.13 23.1,11.49 21.32,11.49 20.52,12.29 18.48,12.29 18.25,12.52 16.35,12.52 15.93,12.93 13.89,12.93 13.39,13.43 13.39,30.96 9.55,34.8 9.55,60.37 34.78,60.37 41.41,53.74 44.17,53.74 45.85,52.07 v1(45.85,48.51)
AB18: length 124.3
  Top Layer w0.254: v1(42.16,65.28) 42.16,64.13 LED45.1
  Inner1 w0.254: v1(42.16,65.28) 42.04,65.28 41.61,65.71 6.24,65.71 3.89,63.36 3.89,31.77 3.95,31.7 5.1,31.7 8.05,28.75 8.05,8.21 11.06,8.21 11.68,7.59 13.71,7.59 14.13,7.18 16.04,7.18 16.27,6.95 18.31,6.95 19.11,6.15 20.89,6.15 21.25,5.79 25.7,5.79 26.35,5.14 27.88,5.14 28.83,4.19 28.83,2.29 29.88,1.24 H2.19
ALU_0: length 156.7
  Top Layer w0.254: v1(67.69,56.9) 67.69,55.82 67.71,55.8
  Inner1 w0.254: v1(67.69,56.9) 67.69,61.34 65.91,63.12 42.16,63.12 40.89,64.39 38.48,64.39 37.52,65.35 6.39,65.35 4.44,63.41 4.44,32.06 5.24,32.06 8.41,28.89 8.41,8.56 11.21,8.56 11.82,7.95 13.86,7.95 14.28,7.53 16.19,7.53 16.42,7.3 18.46,7.3 19.26,6.5 21.04,6.5 21.39,6.15 25.85,6.15 26.5,5.5 28.03,5.5 28.64,4.89 31.05,4.89 31.37,4.57 31.37,2.51 H2.21
ALU_1: length 154.9
  Top Layer w0.254: v1(64.39,56.9) 64.39,55.83 64.36,55.8
  Inner1 w0.254: H2.23 33.78,2.63 33.78,4.7 33.24,5.24 28.78,5.24 28.17,5.85 26.64,5.85 26,6.5 21.54,6.5 21.19,6.86 19.4,6.86 18.6,7.66 16.57,7.66 16.34,7.89 14.43,7.89 14.01,8.31 11.97,8.31 11.36,8.92 8.76,8.92 8.76,29.04 5.39,32.41 4.8,32.41 4.8,63.26 6.53,65 37.37,65 38.33,64.03 40.75,64.03 42.02,62.76 63.73,62.76 64.39,62.1 v1(64.39,56.9)
ALU_2: length 151.7
  Top Layer w0.254: v1(60.58,56.9) 60.58,55.82 60.57,55.8
  Inner1 w0.254: v1(60.58,56.9) 60.58,61.6 59.77,62.41 41.87,62.41 40.6,63.68 38.19,63.68 37.22,64.64 6.68,64.64 5.16,63.11 5.16,32.77 5.54,32.77 9.12,29.19 9.12,9.28 11.51,9.28 12.12,8.66 14.16,8.66 14.58,8.24 16.49,8.24 16.71,8.01 18.75,8.01 19.55,7.21 21.33,7.21 21.69,6.86 26.29,6.86 26.94,6.21 28.32,6.21 28.93,5.6 33.38,5.6 33.9,5.08 35.56,5.08 36.45,4.19 36.45,2.51 H2.25
ALU_3: length 149
  Top Layer w0.254: v1(57.02,57.02) 57.02,55.85 LED56.1
  Inner1 w0.254: v1(57.02,57.02) 57.02,60.71 55.68,62.05 41.72,62.05 40.45,63.32 38.04,63.32 37.08,64.28 6.83,64.28 5.51,62.97 5.51,33.13 5.69,33.13 9.48,29.34 9.48,9.63 11.66,9.63 12.27,9.02 14.3,9.02 14.72,8.6 16.63,8.6 16.86,8.37 18.9,8.37 19.7,7.57 21.48,7.57 21.84,7.21 26.44,7.21 27.09,6.57 28.47,6.57 29.08,5.96 33.53,5.96 34.05,5.44 38.12,5.44 38.86,4.7 38.86,3.65 40.26,2.25 H2.27
ALU_4: length 146.7
  Top Layer w0.254: 53.57,55.8 v1(53.57,57.02)
  Inner1 w0.254: H2.29 42.8,2.25 41.53,3.52 41.53,4.7 40.44,5.79 34.2,5.79 33.68,6.31 29.23,6.31 28.62,6.92 27.23,6.92 26.58,7.57 21.98,7.57 21.63,7.93 19.85,7.93 19.05,8.73 17.01,8.73 16.78,8.96 14.87,8.96 14.45,9.37 12.41,9.37 11.8,9.99 9.83,9.99 9.83,29.48 5.94,33.37 5.94,62.89 6.98,63.93 36.93,63.93 37.89,62.97 40.3,62.97 41.57,61.7 52.6,61.7 53.57,60.73 v1(53.57,57.02)
ALU_5: length 143.7
  Top Layer w0.254: 49.69,55.8 49.69,57.12 v1(49.66,57.15)
  Inner1 w0.254: v1(49.66,57.15) 49.66,60.45 48.77,61.34 41.43,61.34 40.16,62.61 37.74,62.61 36.78,63.57 7.12,63.57 6.3,62.75 6.3,33.52 10.19,29.63 10.19,10.34 11.95,10.34 12.56,9.73 14.6,9.73 15.02,9.31 16.93,9.31 17.16,9.08 19.19,9.08 19.99,8.28 21.78,8.28 22.13,7.93 26.73,7.93 27.38,7.28 28.76,7.28 29.37,6.67 33.83,6.67 34.35,6.15 40.58,6.15 41.34,5.4 43.12,5.4 44.07,4.45 44.07,2.51 H2.31
ALU_6: length 141.3
  Top Layer w0.254: 45.99,55.8 v1(45.99,57.02)
  Inner1 w0.254: v1(45.99,57.02) 45.99,60.18 45.19,60.98 41.28,60.98 40.01,62.25 37.6,62.25 36.63,63.22 7.27,63.22 6.65,62.6 6.65,33.67 10.54,29.78 10.54,10.7 12.1,10.7 12.71,10.09 14.75,10.09 15.17,9.67 17.08,9.67 17.3,9.44 19.34,9.44 20.14,8.64 21.92,8.64 22.28,8.28 26.88,8.28 27.53,7.63 28.91,7.63 29.52,7.02 33.97,7.02 34.49,6.5 40.73,6.5 41.48,5.75 43.27,5.75 43.75,5.27 46.04,5.27 46.61,4.7 46.61,2.51 H2.33
ALU_7: length 138.8
  Top Layer w0.254: LED52.1 v1(42.27,57.02)
  Inner1 w0.254: H2.35 49.15,2.51 49.15,4.32 48.26,5.2 46.61,5.2 46.19,5.62 43.9,5.62 43.41,6.11 41.63,6.11 40.88,6.86 34.64,6.86 34.12,7.38 29.67,7.38 29.06,7.99 27.67,7.99 27.03,8.64 22.43,8.64 22.07,8.99 20.29,8.99 19.49,9.79 17.45,9.79 17.22,10.02 15.31,10.02 14.89,10.44 12.86,10.44 12.24,11.06 10.9,11.06 10.9,29.93 7.01,33.82 7.01,62.45 7.42,62.86 36.49,62.86 37.45,61.9 39.86,61.9 41.13,60.63 42.27,60.63 v1(42.27,57.02)
B13: length 152.7
  Top Layer w0.254: v1(76.33,39.24) SW34.11 76.33,44.96 75.69,45.59 74.67,45.59 74.32,45.95 73.16,45.95 69.8,49.31 69.8,71.31 69.7,71.41 69.7,72.54 68.93,73.31 66.96,73.31 66.61,72.95 61.57,72.95 LED104.1
  Bottom Layer w0.254: H4.5 2.7,18.16 4.57,18.16 4.57,18.32 6.62,20.37 25.23,20.37 29.24,16.36 35.14,16.36 36.86,18.08 36.86,29.81 35.87,30.8 35.87,39.69 39.03,42.85 68.28,42.85 73,38.13 75.21,38.13 v1(76.33,39.24)
B15: length 202
  Top Layer w0.254: v1(2.79,10.41) 2.54,10.67 2.54,11.94 2.41,12.07 2.41,12.32 2.03,12.7 2.03,13.21 2.54,13.72 2.54,20.62 H4.3 ; LED99.1 44.26,72.2 45.09,73.03 46.11,73.03 46.52,73.44 51.86,73.44 52.13,73.71 55.06,73.71 55.72,74.38 60.47,74.38 60.83,74.73 65.87,74.73 66.22,75.09 69.67,75.09 71.48,73.28 71.48,72.15 71.58,72.05 71.58,50.05 73.9,47.73 75.05,47.73 75.41,47.37 76.43,47.37 76.91,46.89 77.55,46.89 77.78,46.66 78.96,46.66 79.44,46.18 79.8,46.18 80.03,45.95 80.8,45.95 81.15,45.59 82.17,45.59 82.42,45.34 82.42,44.57 SW33.9 SW34.16 v1(82.68,38.99)
  Bottom Layer w0.254: v1(82.68,38.99) 81.66,37.97 80.89,37.97 80.56,37.64 78.78,37.64 78.23,37.1 77.47,37.1 77.17,36.8 76.4,36.8 75.95,36.35 72.27,36.35 68.07,40.54 39.24,40.54 37.65,38.95 37.65,31.54 38.63,30.55 38.63,17.34 35.87,14.58 28.51,14.58 24.49,18.59 7.49,18.59 7.49,15.24 5.33,13.08 5.33,10.8 4.95,10.41 v1(2.79,10.41)
B16: length 25.9
  Top Layer w0.254: SW36.1 8.89,43.93 R125.2 7.86,43.55 5.33,41.02 5.33,23.3 H3.3
BUS0: length 137
  Top Layer w0.254: LED106.1 69.09,71.02 69.09,49.02 SW33.16 SW34.9 v1(73.79,39.24)
  Bottom Layer w0.254: v1(73.79,39.24) 69.47,43.56 38.73,43.56 35.15,39.98 35.15,30.51 36.14,29.51 36.14,18.43 34.79,17.07 29.54,17.07 25.53,21.08 5.66,21.08 5.27,20.7 2.7,20.7 H4.4
BUS1: length 142.3
  Top Layer w0.254: LED105.1 66.33,72.17 67.11,72.95 68.78,72.95 69.34,72.39 69.34,71.27 69.44,71.16 69.44,49.16 73.02,45.59 74.17,45.59 74.68,45.09 74.68,44.7 SW33.15 SW34.10 v1(75.06,39.24)
  Bottom Layer w0.254: H3.4 5.06,19.31 6.48,20.73 25.38,20.73 29.39,16.71 34.93,16.71 36.5,18.28 36.5,29.66 35.51,30.65 35.51,39.83 38.88,43.21 68.43,43.21 73.15,38.48 74.29,38.48 v1(75.06,39.24)
BUS3: length 156.6
  Top Layer w0.254: v1(77.6,39.24) SW34.12 SW33.13 77.22,44.7 77.22,45.21 76.96,45.47 76.32,45.47 75.84,45.95 74.82,45.95 74.46,46.31 73.31,46.31 70.16,49.46 70.16,71.46 70.05,71.56 70.05,72.69 69.07,73.66 66.82,73.66 66.46,73.31 61.42,73.31 61.06,72.95 58.02,72.95 LED103.1
  Bottom Layer w0.254: H3.5 3.94,16.77 5.21,18.03 5.21,18.45 6.77,20.01 25.08,20.01 29.1,16 35.28,16 37.21,17.93 37.21,29.96 36.22,30.95 36.22,39.54 39.18,42.49 68.13,42.49 72.86,37.77 75.36,37.77 75.81,38.23 76.58,38.23 v1(77.6,39.24)
BUS4: length 167.6
  Top Layer w0.254: LED102.1 55.03,72.17 56.16,73.31 60.92,73.31 61.27,73.66 66.31,73.66 66.67,74.02 69.22,74.02 70.41,72.83 70.41,71.71 70.51,71.61 70.51,49.61 73.46,46.66 74.61,46.66 74.97,46.31 75.99,46.31 76.47,45.82 77.11,45.82 77.34,45.59 78.52,45.59 78.87,45.25 SW33.12 SW34.13 v1(78.87,39.24)
  Bottom Layer w0.254: H4.6 2.7,15.62 4.44,15.62 5.46,16.63 5.46,17.78 5.56,17.89 5.56,18.3 6.92,19.66 24.94,19.66 28.95,15.65 35.43,15.65 37.57,17.78 37.57,30.11 36.58,31.1 36.58,39.39 39.04,41.86 68.27,41.86 72.71,37.41 75.5,37.41 75.96,37.87 76.73,37.87 77.02,38.17 77.79,38.17 v1(78.87,39.24)
BUS5: length 172.3
  Top Layer w0.254: v1(80.14,39.12) SW34.14 SW33.11 80.14,44.83 79.5,45.47 79.15,45.47 78.67,45.95 77.49,45.95 77.26,46.18 76.62,46.18 76.13,46.66 75.11,46.66 74.76,47.02 73.61,47.02 70.87,49.75 70.87,71.75 70.77,71.86 70.77,72.98 69.37,74.38 66.52,74.38 66.16,74.02 61.12,74.02 60.77,73.66 56.02,73.66 54.99,72.64 54.68,72.95 52.38,72.95 51.6,72.17 LED101.1
  Bottom Layer w0.254: H3.6 3.88,15.21 3.94,15.27 4.59,15.27 5.81,16.49 5.81,16.74 5.97,16.89 5.97,18.2 7.07,19.3 24.79,19.3 28.8,15.29 35.58,15.29 37.92,17.63 37.92,30.25 36.93,31.24 36.93,39.24 39.19,41.5 68.12,41.5 72.56,37.06 75.65,37.06 76.11,37.52 76.88,37.52 77.17,37.81 77.94,37.81 78.48,38.35 79.38,38.35 v1(80.14,39.12)
BUS6: length 192.8
  Top Layer w0.254: LED100.1 45.96,72.38 46.54,72.95 51.88,72.95 52.28,73.36 55.2,73.36 55.87,74.02 60.62,74.02 60.98,74.38 66.02,74.38 66.37,74.73 69.52,74.73 71.12,73.13 71.12,72 71.22,71.9 71.22,49.9 73.75,47.37 74.91,47.37 75.26,47.02 76.28,47.02 76.76,46.53 77.4,46.53 77.63,46.31 78.81,46.31 79.3,45.82 79.65,45.82 79.88,45.59 80.64,45.59 80.78,45.45 80.78,45.2 81.41,44.58 SW33.10 SW34.15 v1(81.41,38.99)
  Inner1 w0.254: v1(2.67,12.95) 2.67,23.03 H4.2
  Bottom Layer w0.254: v1(2.67,12.95) 4.32,12.95 5.58,14.22 5.58,15.75 6.17,16.34 6.17,16.59 6.32,16.74 6.32,18.06 7.21,18.95 24.64,18.95 28.65,14.94 35.73,14.94 38.28,17.49 38.28,30.4 37.29,31.39 37.29,39.1 39.34,41.14 67.97,41.14 72.41,36.7 75.8,36.7 76.26,37.16 77.02,37.16 77.32,37.45 78.08,37.45 78.63,38 80.42,38 v1(81.41,38.99)
CLOCK: length 117.5
  Top Layer w0.254: LED2.1 26.54,73.06 26.54,71.25 22.48,67.18 17.27,67.18 16.78,66.7 9,66.7 6.12,69.58 6.12,77.62 6.89,78.39 8.26,78.39 10.44,80.57 39.94,80.57 40.55,79.97 54.77,79.97 55.22,79.52 55.22,76.89 55.77,76.33 58.41,76.33 58.94,75.8 59.88,75.8 60.24,76.16 65.28,76.16 65.63,76.51 68.31,76.51 72.08,80.28 72.08,81.58 69.09,84.58 H1.49
CLOCK_MODE_SELECT: length 106.8
  Top Layer w0.254: SW35.5 17.78,72.69 17.78,70.02 ; H1.51 70.61,84.46 71.53,83.54 71.53,83.32 72.44,82.4 72.44,80.14 68.46,76.15 65.78,76.15 65.43,75.8 60.38,75.8 60.03,75.44 58.79,75.44 58.26,75.98 55.63,75.98 54.86,76.74 54.86,79.36 54.61,79.61 40.4,79.61 39.8,80.21 10.59,80.21 8.4,78.03 7.04,78.03 6.48,77.47 6.48,69.72 9.14,67.06 16.64,67.06 17.78,68.2 17.78,70.02 ; 17.78,70.02 19.1,70.02 R124.2
COMMAND_0: length 121.4
  Top Layer w0.254: LED28.1 35.82,29.08 v1(35.56,29.08)
  Inner2 w0.254: v1(35.56,29.08) 34.04,30.61 28.57,30.61 27.85,31.32 23.28,31.32 20.87,33.73 22.37,35.23 33.42,35.23 35.64,37.45 35.64,42.94 32.26,46.32 32.26,49.46 31.98,49.74 31.98,78.58 43.49,78.58 45.08,80.16 50.68,80.16 52.4,81.89 65.37,81.89 66.67,83.19 68.96,83.19 69.22,83.44 69.22,85.09 69.98,85.85 69.98,86.49 H1.52
COMMAND_1: length 116.2
  Top Layer w0.254: v1(31.11,29.46) 31.76,29.46 LED27.1
  Inner2 w0.254: H1.50 67.18,86.23 67.18,86.11 66.67,85.6 66.67,83.69 65.23,82.24 52.25,82.24 50.53,80.52 44.93,80.52 43.34,78.93 31.63,78.93 31.63,49.59 31.91,49.31 31.91,46.17 35.28,42.8 35.28,37.6 33.27,35.58 22.22,35.58 20.37,33.73 23.13,30.96 27.71,30.96 28.44,30.23 30.35,30.23 v1(31.11,29.46)
COMMAND_2: length 111.5
  Top Layer w0.254: v1(29.21,28.96) 29.86,28.31 LED26.1
  Inner2 w0.254: v1(29.21,28.96) 27.56,30.61 22.99,30.61 19.86,33.73 22.07,35.94 33.12,35.94 34.93,37.74 34.93,42.65 31.55,46.02 31.55,49.16 31.27,49.44 31.27,79.29 43.19,79.29 44.78,80.88 50.38,80.88 52.11,82.6 63.17,82.6 64.26,83.69 64.26,85.73 65.53,87 H1.48
COMMAND_3: length 107.7
  Top Layer w0.254: v1(23.49,29.85) 23.91,29.85 LED25.1
  Inner2 w0.254: H1.46 61.59,85.73 61.59,83.57 60.98,82.96 51.96,82.96 50.24,81.23 44.63,81.23 43.05,79.65 30.92,79.65 30.92,49.29 31.2,49.01 31.2,45.88 34.57,42.5 34.57,37.89 32.97,36.3 21.93,36.3 18.52,32.89 18.52,32.79 21.46,29.85 v1(23.49,29.85)
COMMAND_4: length 104
  Top Layer w0.254: v1(18.16,30.1) 19.96,30.1 LED24.1
  Inner2 w0.254: v1(18.16,30.1) 18.16,33.02 18.15,33.03 21.78,36.65 32.83,36.65 34.22,38.04 34.22,42.35 30.84,45.73 30.84,48.87 30.56,49.15 30.56,80 42.9,80 44.49,81.59 50.09,81.59 51.81,83.31 58.8,83.31 59.18,83.69 59.18,85.85 H1.44
COMMAND_5: length 100.5
  Top Layer w0.254: LED23.1 16.26,30.15 v1(16.26,30.23)
  Inner2 w0.254: H1.42 56.64,85.85 56.39,85.85 56.32,85.92 52.26,85.92 51.84,85.5 51.56,85.5 51.56,83.57 49.94,81.94 44.34,81.94 42.75,80.36 30.36,80.36 30.2,80.2 30.2,49 30.48,48.72 30.48,45.58 33.86,42.21 33.86,38.19 32.68,37.01 21.63,37.01 16.26,31.63 v1(16.26,30.23)
COMMAND_CODE_0: length 196.7
  Top Layer w0.254: v1(15.88,28.96) 15.88,28.73 LED22.1
  Inner1 w0.254: H1.40 56.48,86.02 64.6,86.02 64.61,85.98 64.64,85.98 64.89,85.73 66.42,85.73 66.8,85.34 66.8,83.69 65.45,82.35 54.91,82.35 52.76,80.2 52.76,72.47 44.26,72.47 42.16,70.37 42.16,69.32 42.93,68.56 64.79,68.56 66.42,66.93 67.69,66.93 68.71,65.91 68.71,48.39 68.07,47.75 41.66,47.75 40.98,48.43 40.98,53.17 34.49,59.66 10.26,59.66 10.26,35.09 12.97,32.39 13.97,32.39 15.11,31.24 15.11,29.72 v1(15.88,28.96)
COMMAND_CODE_1: length 97.3
  Top Layer w0.254: v1(14.48,29.72) 13.2,29.72 LED21.1
  Inner2 w0.254: H1.38 52.83,87 51.69,85.85 49.4,85.85 49.15,85.6 49.15,83.95 47.5,82.3 44.19,82.3 42.6,80.71 30.21,80.71 29.85,80.35 29.85,48.85 30.13,48.57 30.13,45.43 33.5,42.06 33.5,38.33 32.53,37.36 21.48,37.36 15.11,30.99 15.11,30.35 v1(14.48,29.72)
COMMAND_CODE_2: length 99.3
  Top Layer w0.254: v1(14.48,30.86) 14.22,30.61 8.13,30.61 7.67,30.15 LED20.1
  Inner2 w0.254: v1(14.48,30.86) 21.34,37.72 32.38,37.72 33.15,38.48 33.15,41.91 29.77,45.29 29.77,48.42 29.49,48.7 29.49,80.5 30.06,81.07 42.46,81.07 44.7,83.31 46.35,83.31 46.35,85.09 47.12,85.85 48.51,85.85 48.89,86.23 49.4,86.23 H1.36
COMMAND_R1: length 19
  Top Layer w0.254: H2.28 40.26,20.91 CLK_HALT.1
COMMAND_R2: length 19.5
  Top Layer w0.254: RAM_A_IN.1 43.31,20.22 43.31,4.29 H2.30
COMMAND_R3: length 20
  Top Layer w0.254: H2.32 45.34,6.09 46.74,7.49 46.74,20.06 DAM_D_IN.1
COMMAND_R4: length 20.4
  Top Layer w0.254: RAM_D_OUT.1 50.67,20.26 50.67,10.54 50.55,10.41 50.55,6.45 H2.34
COMMAND_R5: length 20.9
  Top Layer w0.254: COM_REG_IN.1 54.36,20.35 54.36,7.72 H2.36
COMMAND_R6: length 21.8
  Top Layer w0.254: H2.38 55.4,6.22 56.26,6.22 57.91,7.87 57.91,20.25 COM_REG_OUT.1
COMMAND_R7: length 21.8
  Top Layer w0.254: A_REG_IN.1 61.34,20.09 61.34,10.54 55.5,4.7 H2.40
COMMAND_R8: length 22.2
  Top Layer w0.254: H2.42 58.04,6.35 64.9,13.21 64.9,20.1 A_REG_OUT.1
COMMAND_R9: length 22.6
  Top Layer w0.254: H2.44 60.58,8.38 68.71,16.51 68.71,20.39 B_REG_IN.1
COMMAND_R13: length 30.4
  Top Layer w0.254: DISPLAY_EN.1 85.47,22.22 83.19,19.94 83.19,16 82.43,15.24 79.5,15.24 78.76,14.5 75.45,14.5 75.12,14.17 71.96,14.17 70.74,12.95 H2.52
COMMAND_R14: length 52.6
  Top Layer w0.254: v1(42.42,14.48) 41.65,13.71 PC_EN.1
  Inner2 w0.254: v1(42.42,14.48) 43.31,15.37 46.61,15.37 46.86,15.11 46.86,14.35 44.33,11.81 43.69,11.81 40.28,8.41 11.96,8.41 11.05,7.5 11.05,2.51 H2.3
COMMAND_R15: length 47.4
  Top Layer w0.254: v1(45.97,14.61) 45.08,13.71 PC_IN.1
  Inner2 w0.254: H2.1 8.64,2.64 8.64,5.59 11.81,8.76 40.13,8.76 v1(45.97,14.61)
COMMAND_R16: length 127.9
  Top Layer w0.254: PC_OUT.1 48.7,14.17 v1(48.26,14.61)
  Inner2 w0.254: H1.10 17.27,86.49 16.45,85.66 11.37,85.66 11.05,85.34 11.05,83.57 11.87,82.74 14.8,82.74 15.42,82.12 20.77,82.12 21.86,81.02 23.9,81.02 24.1,80.83 24.1,50 21.59,47.5 20.7,47.5 18.9,45.7 15.73,45.7 12.07,42.04 11.3,42.04 10.16,40.89 10.16,39.5 13.33,36.32 13.33,29.85 14.99,28.19 36.83,28.19 46.61,18.42 46.61,16.26 v1(48.26,14.61)
COMMAND_REG0: length 76.6
  Top Layer w0.254: LED38.1 34.8,17.59 v1(34.8,17.91)
  Bottom Layer w0.254: v1(34.8,17.91) 34.8,46.61 44.58,56.39 44.58,81.41 46.35,83.19 46.35,85.09 47.75,86.49 H1.34
COMMAND_REG1: length 78.3
  Top Layer w0.254: LED37.1 31.02,16.29 v1(32.89,18.16)
  Bottom Layer w0.254: v1(32.89,18.16) 33.15,18.16 34.44,19.46 34.44,46.76 44.22,56.54 44.22,81.13 43.81,81.53 43.81,85.73 H1.32
COMMAND_REG2: length 82.1
  Top Layer w0.254: v1(30.73,17.65) 27.55,17.65 LED36.1
  Bottom Layer w0.254: v1(30.73,17.65) 32.26,19.18 33.15,19.18 34.09,20.12 34.09,46.9 43.86,56.68 43.86,80.98 41.4,83.44 41.4,85.47 42.04,86.11 42.04,86.49 H1.30
COMMAND_REG3: length 87.2
  Top Layer w0.254: v1(29.72,18.54) 29.19,18.01 27.4,18.01 26.92,17.53 23.78,17.53 LED35.1
  Bottom Layer w0.254: v1(29.72,18.54) 31.12,18.54 32.11,19.53 33,19.53 33.73,20.26 33.73,47.05 43.51,56.83 43.51,80.83 41.03,83.31 38.99,83.31 38.99,85.98 H1.28
COMMAND_REG4: length 92.8
  Top Layer w0.254: LED39.1 19.92,17.53 23.28,17.53 23.63,17.88 25.91,17.88 27.08,19.05 29.21,19.05 29.59,19.43 v1(29.72,19.43)
  Bottom Layer w0.254: H1.26 37.59,87 36.32,85.73 36.32,84.07 37.44,82.96 40.88,82.96 43.15,80.69 43.15,56.98 33.37,47.2 33.37,20.5 32.77,19.89 31.96,19.89 31.12,19.05 30.1,19.05 v1(29.72,19.43)
COMMAND_REG5: length 97.6
  Top Layer w0.254: LED34.1 16.1,17.53 19.41,17.53 19.77,17.88 23.13,17.88 23.48,18.24 25.02,18.24 26.34,19.56 28.19,19.56 28.7,20.07 v1(28.96,20.07)
  Bottom Layer w0.254: v1(28.96,20.07) 31.64,20.07 33.02,21.45 33.02,47.35 41.66,55.98 41.66,57.53 42.8,58.67 42.8,80.54 40.73,82.6 37.29,82.6 36.71,83.19 34.54,83.19 33.78,83.95 33.78,85.85 H1.24
COMMAND_REG6: length 104.9
  Top Layer w0.254: v1(28.32,20.96) 27.23,20.96 24.87,18.59 23.34,18.59 22.98,18.24 19.62,18.24 19.27,17.88 15.95,17.88 15.72,17.65 12.62,17.65 LED33.1
  Bottom Layer w0.254: H1.22 31.24,85.85 31.24,83.57 31.98,82.83 36.56,82.83 37.14,82.24 40.59,82.24 42.44,80.39 42.44,66.83 41.28,65.66 41.28,65.02 42.44,63.86 42.44,58.82 41.3,57.68 41.3,56.13 32.66,47.49 32.66,40.41 31.62,39.37 31.62,38.48 32.66,37.44 32.66,21.6 32.02,20.96 v1(28.32,20.96)
COMMAND_REG7: length 110.6
  Top Layer w0.254: v1(28.07,21.84) 27.62,21.84 24.72,18.95 23.19,18.95 22.83,18.59 19.47,18.59 19.12,18.24 15.8,18.24 15.57,18.01 12.47,18.01 11.6,17.15 8.51,17.15 LED32.1
  Bottom Layer w0.254: v1(28.07,21.84) 28.83,21.84 29.36,21.31 31.87,21.31 32.31,21.74 32.31,37.29 31.27,38.33 31.27,39.52 32.31,40.56 32.31,47.64 40.94,56.28 40.94,57.83 42.09,58.97 42.09,63.71 40.92,64.88 40.92,65.81 42.09,66.97 42.09,80.24 40.44,81.89 37,81.89 36.41,82.48 29.92,82.48 28.7,83.69 28.7,86.11 29.72,87.12 H1.20
COUNTER_0: length 29.9
  Top Layer w0.254: H1.18 28.45,86.11 28.45,85.98 28.83,85.6 28.83,83.76 29.08,83.5 44.67,83.5 45.82,82.35 49.09,82.35 49.27,82.17 52.36,82.17 LED43.1
COUNTER_1: length 29.1
  Top Layer w0.254: LED42.1 49.4,81.44 49.4,81.53 48.94,81.99 45.67,81.99 44.52,83.15 26.42,83.15 26.16,83.4 26.16,85.34 25.91,85.6 25.91,86.11 H1.16
COUNTER_2: length 28.4
  Top Layer w0.254: LED41.1 44.37,82.79 23.75,82.79 23.49,83.05 23.49,86.36 23.11,86.36 H1.14
COUNTER_3: length 27.2
  Top Layer w0.254: H1.12 19.81,87 21.08,85.73 21.08,82.69 21.34,82.44 41.09,82.44 LED40.1
D16: length 34.2
  Top Layer w0.254: SW36.2 10.16,43.68 R126.2 9.28,42.8 7.62,42.8 5.69,40.87 5.69,21.31 4.95,20.57 3.17,20.57 2.67,21.08 2.67,23.17 H3.2
D17: length 62.5
  Top Layer w0.254: LED70.1 9.18,37.75 v1(11.05,39.62)
  Inner2 w0.254: H1.17 26.64,83.8 26.64,47.52 26.92,47.24 26.92,45.72 26.54,45.34 15.88,45.34 10.92,40.39 10.92,39.75 v1(11.05,39.62)
D19: length 55.3
  Top Layer w0.254: v1(20.57,46.48) 19.8,45.7 SW32.3 19.8,42.97 R23.2
  Inner2 w0.254: H1.5 13.46,83.31 14.73,83.31 15.57,82.48 20.92,82.48 22.01,81.38 24.05,81.38 24.45,80.98 24.45,49.08 22.72,47.35 22.08,47.35 21.72,46.99 21.08,46.99 v1(20.57,46.48)
E13: length 116.3
  Top Layer w0.254: v1(41.4,2.54) 40,2.54 39.12,1.65 38.86,1.65 38.17,2.34 15.79,2.34 15.59,2.54 13.84,2.54 12.6,3.78 H2.6
  Bottom Layer w0.254: LED68.8 55.75,33.4 55.75,26.14 56.01,25.88 57.76,25.88 58.1,26.22 58.1,27.63 58.92,28.45 63.25,28.45 63.25,26.16 62.48,25.4 60.19,25.4 60.02,25.23 60.02,25.11 58.99,24.08 52,24.08 50.91,22.99 47.9,22.99 46.1,24.79 44.6,24.79 43.18,23.37 43.18,16.37 44.12,15.43 44.12,13.27 43.11,12.27 39.93,12.27 37.69,10.03 32.26,10.03 32.26,7.1 33.08,6.28 37.92,6.28 38.98,5.21 40.89,5.21 41.4,4.7 v1(41.4,2.54)
E14: length 140.7
  Top Layer w0.254: v1(67.82,65.02) 67.82,64.09 LED44.1
  Inner1 w0.254: H2.5 10.92,2.63 10.92,4.83 10.03,5.72 6.6,5.72 5.46,6.86 5.46,27.81 4.06,29.21 2.92,29.21 1.4,30.73 1.4,64.39 5.21,68.2 64.64,68.2 v1(67.82,65.02)
E19: length 59.8
  Top Layer w0.254: 11.56,45.21 11.56,46.3 10.74,47.12 5.84,47.12 1.78,51.18 1.78,84.96 1.91,84.96 2.79,85.85 10.92,85.85 H1.6 ; 11.56,45.21 SW36.3 ; 11.56,45.21 R127.2
F14: length 63.7
  Top Layer w0.254: LED68.12 47.5,35.31 v1(46.99,35.31)
  Bottom Layer w0.254: H2.4 9.78,3.81 11.41,5.44 16.11,5.44 16.21,5.54 16.72,5.54 17.61,6.43 18.53,6.43 18.89,6.78 26.89,6.78 26.9,6.79 26.9,13.59 36.22,13.59 39.62,17 39.62,26.41 40.77,27.55 40.77,29.08 v1(46.99,35.31)
F16: length 75.5
  Inner1 w0.254: LED68.9 57.25,37.08 55.98,35.81 48.64,35.81 48.26,36.2 v1(46.35,36.2)
  Bottom Layer w0.254: H2.2 9.68,6.22 16.9,6.22 17.46,6.78 18.38,6.78 18.74,7.14 26.54,7.14 26.54,13.95 36.07,13.95 39.27,17.15 39.27,26.56 40.41,27.7 40.41,29.23 46.35,35.17 v1(46.35,36.2)
F18: length 61.1
  Top Layer w0.254: LED71.1 11.81,38.31 v1(11.81,40.01)
  Inner2 w0.254: v1(11.81,40.01) 13.08,41.28 13.08,42.04 16.02,44.98 26.69,44.98 27.28,45.57 27.28,47.39 27,47.67 27,81.61 H1.19
F19: length 35.9
  Top Layer w0.254: LED10.1 38.35,69.14 v1(38.35,69.6)
  Inner1 w0.254: H1.37 52.83,82.55 51.33,81.05 51.33,73.89 43.16,73.89 39.25,69.98 38.73,69.98 v1(38.35,69.6)
G13: length 129.9
  Top Layer w0.254: v1(49.66,65.15) LED47.1
  Inner1 w0.254: v1(49.66,65.15) 49.66,66.04 49.28,66.42 5.94,66.42 3.18,63.65 3.18,31.47 3.66,30.99 4.8,30.99 7.34,28.45 7.34,7.5 10.77,7.5 11.38,6.88 13.42,6.88 13.84,6.46 15.75,6.46 15.98,6.23 18.01,6.23 18.81,5.43 20.6,5.43 20.95,5.08 23.37,5.08 23.62,4.83 23.62,2.63 H2.15
G15: length 79.1
  Bottom Layer w0.254: H2.12 18.86,2.7 16.51,2.7 16.26,2.95 16.26,4.57 16.51,4.83 17.02,4.83 17.91,5.72 18.83,5.72 19.18,6.07 27.18,6.07 27.61,6.5 27.61,12.88 36.51,12.88 40.34,16.7 40.34,25.72 42.25,27.64 46.56,27.64 49.71,30.78 49.71,33.44 50.36,34.1 50.36,38.04 50.8,38.48 60.58,38.48 LED68.7
G16: length 60.1
  Bottom Layer w0.254: H2.10 19.33,5.72 27.33,5.72 27.97,6.35 27.97,12.52 36.66,12.52 40.69,16.56 40.69,25.57 42.4,27.28 46.71,27.28 50.06,30.63 50.06,33.29 52.07,35.3 52.07,36.83 LED68.11
G17: length 136.6
  Top Layer w0.254: v1(60.45,65.02) 60.55,64.93 LED50.1
  Inner1 w0.254: H2.9 16.73,1.91 16.13,1.91 16.13,4.57 15.31,5.4 13.4,5.4 12.98,5.81 10.94,5.81 10.33,6.43 6.9,6.43 6.17,7.15 6.17,28.11 4.36,29.92 3.22,29.92 2.11,31.03 2.11,64.09 5.5,67.49 58.5,67.49 60.45,65.53 v1(60.45,65.02)
G18: length 84.2
  Top Layer w0.254: v1(38.99,2.41) 38.7,2.7 15.94,2.7 H2.8
  Bottom Layer w0.254: v1(38.99,2.41) 38.99,4.7 37.77,5.92 32.93,5.92 31.9,6.95 31.9,10.39 37.54,10.39 39.78,12.62 42.97,12.62 43.76,13.42 43.76,15.28 42.83,16.22 42.83,23.52 44.45,25.14 46.25,25.14 48.05,23.34 50.76,23.34 51.85,24.43 58.85,24.43 59.66,25.25 59.66,25.37 61.21,26.92 LED68.6
G21: length 52.3
  Top Layer w0.254: v1(21.59,46.36) 21.07,45.83 SW32.4 21.07,42.59 R24.2
  Inner2 w0.254: H1.7 15.24,84.58 16.99,82.83 21.06,82.83 22.16,81.74 24.2,81.74 24.86,81.07 24.86,48.99 22.86,46.99 22.22,46.99 v1(21.59,46.36)
G22: length 61.3
  Top Layer w0.254: R128.2 13.21,44.83 SW36.4 12.7,46.22 11.04,47.88 5.58,47.88 2.13,51.33 2.13,80.24 4.83,82.93 12.83,82.93 13.33,83.44 13.33,85.22 14.73,86.61 H1.8
H13: length 50.2
  Bottom Layer w0.254: LED68.2 51.69,26.8 51.69,25.78 50.32,24.41 48.49,24.41 46.69,26.21 42.84,26.21 41.76,25.13 41.76,16.11 37.1,11.46 30.88,11.46 30.84,11.41 30.84,6.5 31.24,6.1 31.24,2.95 30.99,2.7 26.26,2.7 25.18,3.78 H2.16
H14: length 132.2
  Top Layer w0.254: LED48.1 53.34,64.06 v1(53.34,65.15)
  Inner1 w0.254: v1(53.34,65.15) 53.34,66.42 52.99,66.78 5.8,66.78 2.82,63.8 2.82,31.32 3.51,30.63 4.65,30.63 6.88,28.4 6.88,7.45 7.19,7.14 10.62,7.14 11.23,6.53 13.27,6.53 13.69,6.11 15.6,6.11 15.83,5.88 17.87,5.88 18.67,5.08 20.45,5.08 21.08,4.45 21.08,2.63 H2.13
H15: length 134.7
  Top Layer w0.254: LED49.1 v1(57.02,65.02)
  Inner1 w0.254: v1(57.02,65.02) 57.02,66.42 56.31,67.13 5.65,67.13 2.46,63.95 2.46,31.18 3.36,30.28 4.51,30.28 6.53,28.26 6.53,7.3 7.05,6.78 10.48,6.78 11.09,6.17 13.12,6.17 13.54,5.75 15.45,5.75 15.68,5.52 17.72,5.52 18.67,4.57 18.67,2.51 H2.11
H17: length 41.1
  Bottom Layer w0.254: H2.18 28.32,4.55 28.32,12.17 36.81,12.17 41.05,16.41 41.05,25.43 42.54,26.92 LED68.1
H18: length 139.6
  Top Layer w0.254: LED51.1 64.39,64.17 v1(64.39,65.02)
  Inner1 w0.254: H2.7 13.59,2.51 13.59,4.7 12.83,5.46 10.79,5.46 10.18,6.07 6.75,6.07 5.82,7.01 5.82,27.96 4.21,29.57 3.07,29.57 1.75,30.88 1.75,64.24 5.35,67.84 63.22,67.84 64.39,66.68 v1(64.39,65.02)
H20: length 65.8
  Top Layer w0.254: LED73.1 17.57,38.86 v1(17.53,38.86)
  Inner2 w0.254: H1.23 35.05,84.46 33.55,82.96 29.35,82.96 27.71,81.32 27.71,47.97 27.99,47.69 27.99,45.28 26.99,44.27 16.32,44.27 14.96,42.91 14.96,41.17 17.27,38.86 v1(17.53,38.86)
H22: length 49.9
  Top Layer w0.254: v1(22.73,46.36) 22.34,45.96 SW32.5 22.67,44.11 R25.2
  Inner2 w0.254: v1(22.73,46.36) 23.49,47.12 24.13,47.12 25.22,48.2 25.22,81.21 24.34,82.09 22.31,82.09 21.21,83.19 18.67,83.19 H1.9
J14: length 103.4
  Bottom Layer w0.254: LED68.4 63.25,33.27 63.25,38.23 62.48,38.99 49.4,38.99 48.13,37.72 48.13,29.71 46.42,27.99 42.1,27.99 41.8,27.69 41.4,27.69 39.98,26.26 39.98,16.85 36.36,13.23 27.25,13.23 27.25,6.65 27.03,6.43 19.04,6.43 18.68,6.07 17.76,6.07 16.87,5.18 16.36,5.18 16.26,5.08 14.35,5.08 13.59,4.32 13.59,3.05 14.29,2.34 19,2.34 19.07,2.41 21.21,2.41 21.21,2.51 H2.14
J15: length 126.9
  Top Layer w0.254: LED46.1 45.97,64.1 v1(45.97,65.15)
  Inner1 w0.254: H2.17 26.29,2.51 26.29,4.7 25.55,5.43 21.1,5.43 20.74,5.79 18.96,5.79 18.16,6.59 16.12,6.59 15.9,6.82 13.99,6.82 13.57,7.24 11.53,7.24 10.92,7.85 7.7,7.85 7.7,28.6 4.95,31.35 3.81,31.35 3.53,31.62 3.53,63.5 6.09,66.06 44.81,66.06 45.72,65.15 v1(45.97,65.15)
J16: length 86.5
  Top Layer w0.254: H1.53 73.15,78.36 70.24,75.44 66.08,75.44 65.72,75.09 60.68,75.09 60.32,74.73 55.57,74.73 54.91,74.07 51.98,74.07 51.71,73.8 46.38,73.8 46.26,73.69 41.64,73.69 41.05,74.27 41.05,77.96 39.5,79.5 10.88,79.5 10.03,78.65 10.03,77.72 12.25,75.51 SW1.1 12.25,69.42 R3.2
J19: length 35
  Top Layer w0.254: v1(39.88,69.6) 39.88,66.92 LED11.1
  Inner1 w0.254: H1.39 51.69,80.9 51.69,73.53 43.81,73.53 v1(39.88,69.6)
J20: length 71.2
  Top Layer w0.254: LED74.1 21.23,38.99 v1(20.19,38.99)
  Inner2 w0.254: v1(20.19,38.99) 19.56,39.62 17.01,39.62 15.32,41.32 15.32,42.77 16.46,43.92 27.13,43.92 28.35,45.13 28.35,47.83 28.07,48.11 28.07,81.17 29.39,82.49 35.5,82.49 H1.25
K14: length 81.9
  Top Layer w0.254: H1.55 74.42,85.85 72.77,85.85 71.88,84.96 71.88,83.46 72.8,82.55 72.8,78.51 70.09,75.8 65.93,75.8 65.57,75.44 60.53,75.44 60.18,75.09 58.64,75.09 58.11,75.62 45.78,75.62 45.59,75.44 45.34,75.69 42.04,75.69 41.4,76.33 41.4,78.11 39.65,79.86 10.74,79.86 LED1.1
K17: length 59.5
  Top Layer w0.254: v1(32.89,68.96) 32.89,66.26 31.45,64.82 28.91,64.82 28.68,64.59 26.88,64.59 26.63,64.34 25.12,64.34 24.89,64.11 21.71,64.11 21.1,63.5 17.76,63.5 LED7.1
  Inner1 w0.254: v1(32.89,68.96) 33.27,68.96 33.66,68.58 38.1,68.58 38.12,68.56 39.47,68.56 39.52,68.61 40.36,68.61 41,69.25 41,69.71 44.11,72.82 52.4,72.82 52.4,80.35 54.76,82.7 56.66,82.7 57.27,83.31 59.18,83.31 H1.43
K19: length 52.5
  Top Layer w0.254: LED6.1 21.85,63.75 25.03,63.75 25.26,63.98 26.78,63.98 27.03,64.24 28.82,64.24 29.05,64.47 31.6,64.47 34.29,67.15 v1(34.29,69.22)
  Inner1 w0.254: v1(34.29,69.22) 34.54,68.96 40.21,68.96 40.64,69.39 40.64,69.85 43.96,73.18 52.04,73.18 52.04,80.49 54.61,83.06 56.51,83.06 57.91,84.46 H1.41
K21: length 47.5
  Top Layer w0.254: v1(23.88,46.36) 23.88,44.72 SW32.6 23.61,43.02 R26.2
  Inner2 w0.254: v1(23.88,46.36) 24.64,47.12 25.15,47.12 25.58,47.55 25.58,81.36 24.49,82.45 22.45,82.45 20.32,84.58 H1.11
L14: length 95.2
  Top Layer w0.254: v1(61.59,81.03) 62.99,82.42 H1.45 ; R6.2 5.8,54.65 5.46,54.99 5.46,57.5 SW31.5 5.71,60.36 5.71,68.97 5.41,69.28 5.41,77.91 6.59,79.1 7.96,79.1 9.52,80.66 v1(9.52,81.15)
  Inner1 w0.254: v1(9.52,81.15) 9.91,80.77 10.92,80.77 11.43,81.28 11.43,81.66 12.6,82.83 36.19,82.83 39.62,79.4 v1(39.62,77.09) ; v1(61.72,81.03) v1(61.59,81.03)
  Inner2 w0.254: v1(61.72,81.03) 61.22,81.53 52.55,81.53 50.83,79.81 45.22,79.81 43.64,78.22 42.66,78.22 41.53,77.09 v1(39.62,77.09)
L16: length 39.2
  Top Layer w0.254: LED9.1 29.35,63.75 32.47,63.75 36.7,67.99 v1(36.7,69.6)
  Inner1 w0.254: H1.35 50.98,83.9 50.98,74.42 50.8,74.25 43.01,74.25 39.15,70.38 38.12,70.38 37.62,69.88 36.98,69.88 v1(36.7,69.6)
L19: length 43.8
  Top Layer w0.254: LED8.1 25.41,63.63 26.92,63.63 27.18,63.88 28.97,63.88 29.2,64.11 31.75,64.11 35.56,67.92 35.56,70.1 v1(35.69,70.23)
  Inner1 w0.254: H1.33 50.62,81.71 50.62,74.6 42.87,74.6 39,70.74 37.98,70.74 37.47,70.23 v1(35.69,70.23)
L21: length 45
  Top Layer w0.254: v1(25.02,46.36) 24.88,46.21 SW32.7 25.35,43.97 25.35,42.88 25.88,42.35 R27.2
  Inner2 w0.254: v1(25.02,46.36) 25.78,47.12 25.93,47.12 25.93,81.51 24.64,82.8 24.13,82.8 H1.13
M13: length 180.3
  Top Layer w0.254: v1(18.41,47.37) 18.53,47.26 SW32.2 18.53,43.29 R22.2
  Inner1 w0.254: H1.56 74.42,85.85 74.42,83.82 73.6,83 69.02,83 67.58,81.56 64.16,81.56 62.86,80.26 61.47,80.26 61.21,80.52 60.86,80.52 59.82,81.56 55.12,81.56 53.47,79.9 53.47,71.75 44.55,71.75 43.22,70.42 43.22,69.27 65.09,69.27 66.71,67.64 67.99,67.64 69.42,66.21 69.42,48.09 68.37,47.04 41.36,47.04 40.26,48.14 40.26,52.87 34.19,58.94 10.98,58.94 10.98,54.04 16.89,48.13 17.65,48.13 v1(18.41,47.37)
M15: length 107.7
  Top Layer w0.254: v1(10.67,81.41) 10.67,81.3 8.11,78.74 6.74,78.74 5.77,77.77 5.77,69.43 8.85,66.34 16.93,66.34 17.41,66.83 19.46,66.83 ; 19.46,66.83 22.63,66.83 26.9,71.1 26.9,71.37 30.73,71.37 30.99,71.63 30.99,73.62 LED29.1 ; 19.46,66.83 19.43,66.8
  Inner1 w0.254: H1.47 64.45,85.66 47.05,85.66 46.48,85.09 46.48,83.69 45.97,83.19 12.45,83.19 v1(10.67,81.41)
M18: length 62.2
  Top Layer w0.254: LED72.1 14.86,38.86 v1(14.6,39.12)
  Inner2 w0.254: v1(14.6,39.12) 14.6,43.06 16.17,44.63 26.84,44.63 27.64,45.43 27.64,47.54 27.36,47.82 27.36,81.46 29.21,83.31 31.62,83.31 32.51,84.2 H1.21
M22: length 43.5
  Top Layer w0.254: v1(26.29,46.36) 26.29,44.59 SW32.8 27.56,43.03 R28.2
  Inner2 w0.254: H1.15 26.29,83.19 v1(26.29,46.36)
N14: length 166.6
  Top Layer w0.254: LED67.1 64.22,48.72 v1(64.26,48.77)
  Inner1 w0.254: H2.39 54.86,1.87 54.86,2.54 54.23,3.18 54.23,4.57 53.18,5.62 48.85,5.62 48.56,5.92 46.9,5.92 46.48,6.34 44.19,6.34 43.71,6.82 41.93,6.82 41.17,7.57 34.94,7.57 34.42,8.09 29.96,8.09 29.35,8.7 27.97,8.7 27.32,9.35 22.72,9.35 22.37,9.71 20.58,9.71 19.78,10.51 17.75,10.51 17.52,10.74 15.61,10.74 15.19,11.15 13.15,11.15 12.54,11.77 11.61,11.77 11.61,30.22 7.75,34.09 7.75,61.98 7.92,62.15 35.52,62.15 42.14,55.52 60.69,55.52 64.26,51.95 v1(64.26,48.77)
N18: length 82.2
  Top Layer w0.254: LED76.1 28.48,39.12 v1(27.69,39.12)
  Inner2 w0.254: v1(27.69,39.12) 26.92,39.88 21.46,39.88 21.36,39.98 20.21,39.98 19.85,40.34 17.31,40.34 16.03,41.62 16.03,42.47 16.76,43.2 27.43,43.2 29.06,44.84 29.06,48.13 28.78,48.41 28.78,80.87 29.69,81.78 40.51,81.78 42.67,83.95 H1.29
N20: length 76.8
  Top Layer w0.254: LED75.1 24.8,39.12 v1(24.64,39.12)
  Inner2 w0.254: H1.27 40.13,84.07 38.2,82.14 29.54,82.14 28.42,81.02 28.42,48.26 28.7,47.98 28.7,44.98 27.28,43.56 16.61,43.56 15.67,42.62 15.67,41.47 17.16,39.98 19.71,39.98 20.06,39.62 21.21,39.62 21.72,39.12 v1(24.64,39.12)
R14: length 167.1
  Top Layer w0.254: LED60.1 67.89,48.82 v1(67.82,48.9)
  Inner1 w0.254: 7.98,62.5 35.67,62.5 42.29,55.88 60.83,55.88 v1(67.82,48.9) ; H2.37 51.69,2.51 51.69,4.57 50.99,5.27 48.7,5.27 48.41,5.56 46.75,5.56 46.33,5.98 44.04,5.98 43.56,6.46 41.78,6.46 41.03,7.22 34.79,7.22 34.27,7.74 29.82,7.74 29.21,8.35 27.82,8.35 27.17,8.99 22.57,8.99 22.22,9.35 20.44,9.35 19.64,10.15 17.6,10.15 17.37,10.38 15.46,10.38 15.04,10.8 13,10.8 12.39,11.41 11.26,11.41 11.26,30.07 7.37,33.96 7.37,62.23 7.64,62.5 7.87,62.5
R17: length 176.6
  Top Layer w0.254: R21.2 17.26,43.7 SW32.1 17.26,46.97 v1(17.4,47.12)
  Inner1 w0.254: H1.54 71.75,85.73 69.72,85.73 69.34,85.34 69.34,83.82 67.44,81.92 54.98,81.92 53.11,80.05 53.11,72.11 44.41,72.11 42.52,70.22 42.52,69.46 43.07,68.91 64.94,68.91 66.56,67.29 67.84,67.29 69.06,66.06 69.06,48.24 68.22,47.4 41.51,47.4 40.62,48.29 40.62,53.02 34.34,59.3 10.62,59.3 10.62,53.9 v1(17.4,47.12)
